# EasyEDA Pro project ProProject_心电第二版（最终版）_2024-06-08.epro

# Schematic schematic1
Create Date: 2024-05-25; Page Name: P1; Project Name: 心电第二版; Schematic Name: schematic1; Update Date: 2024-05-30; Company: 嘉立创EDA; Page Size: A4; Version: V1.0
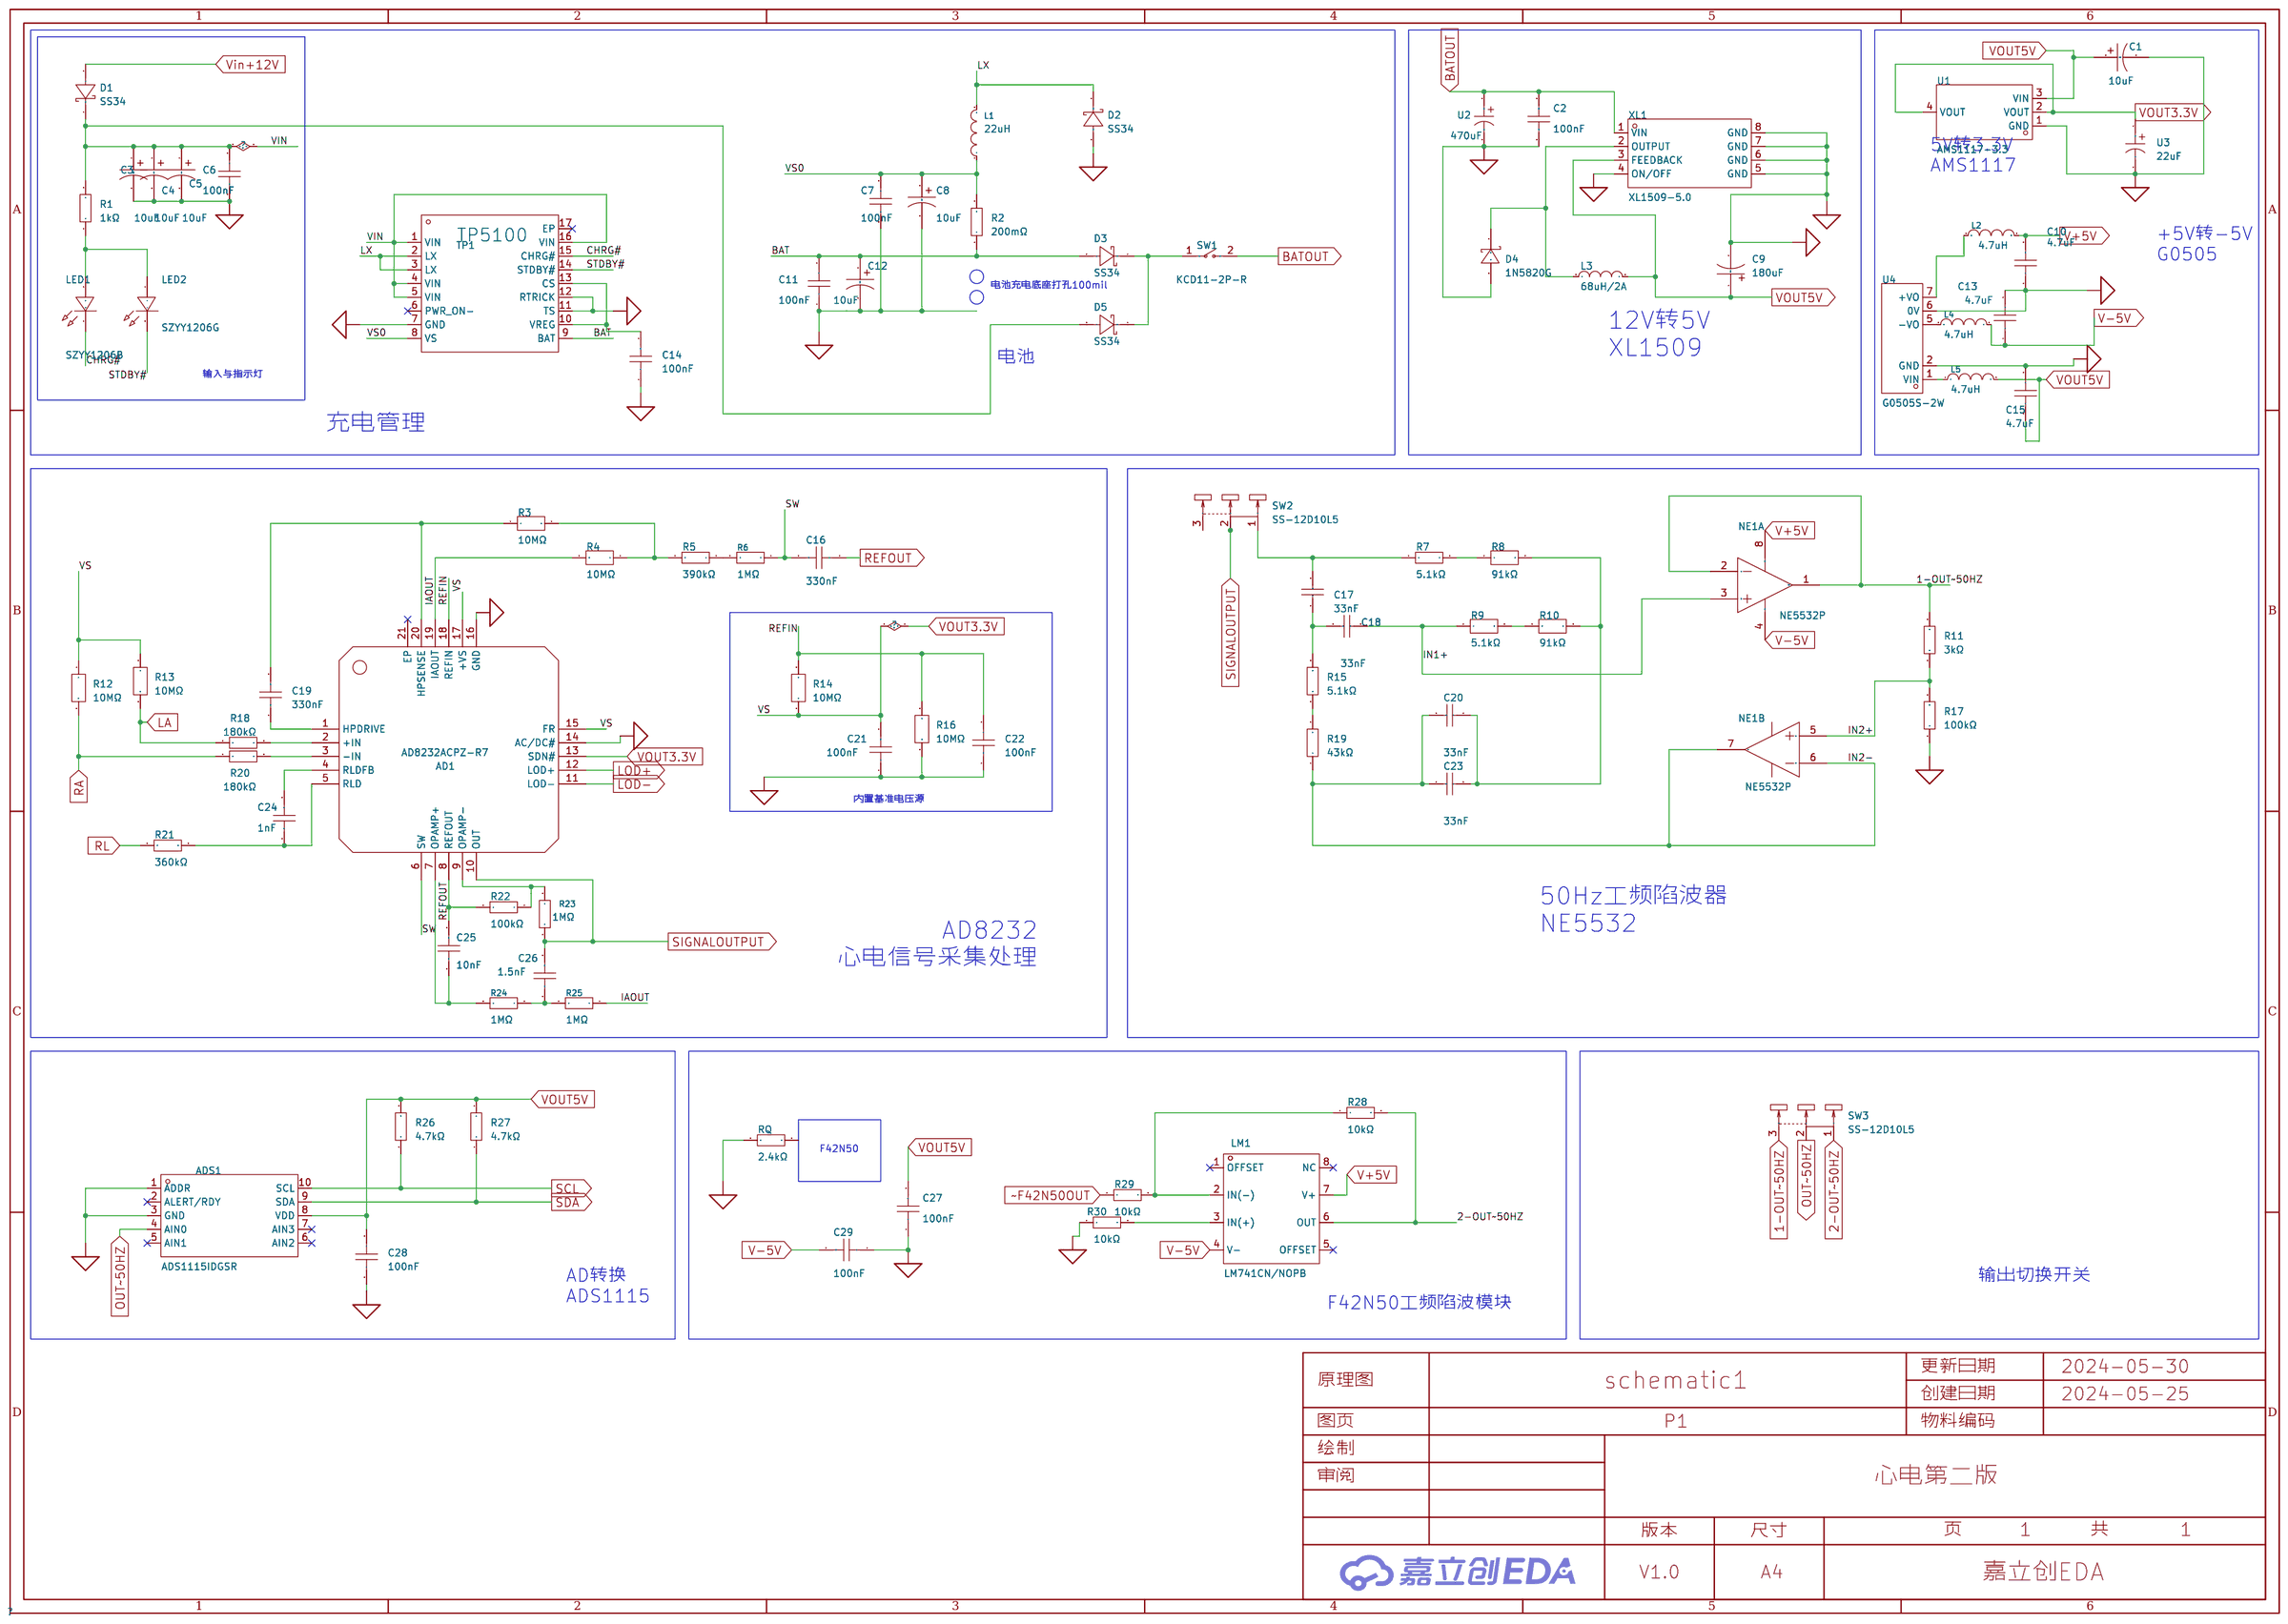
[diagram p0: schematic sheet]

## Parts
AD1  AD8232ACPZ-R7  [LFCSP-20_L4.0-W4.0-P0.50-TL-EP2.7]
ADS1  ADS1115IDGSR  [MSOP-10_L3.0-W3.0-P0.50-LS5.0-BL]
C1  10uF  [CAP-TH_BD5.0-P2.00-D0.8-FD]
C2  100nF  [C1206]
C3  10uF  [CAP-TH_BD5.0-P2.00-D0.8-FD]
C4  10uF  [CAP-TH_BD5.0-P2.00-D0.8-FD]
C5  10uF  [CAP-TH_BD5.0-P2.00-D0.8-FD]
C6  100nF  [C1206]
C7  100nF  [C1206]
C8  10uF  [CAP-TH_BD5.0-P2.00-D0.8-FD]
C9  180uF  [CAP-TH_BD8.0-P3.50-D0.6-FD]
C10  4.7uF  [C1206]
C11  100nF  [C1206]
C12  10uF  [CAP-TH_BD5.0-P2.00-D0.8-FD]
C13  4.7uF  [C1206]
C14  100nF  [C1206]
C15  4.7uF  [C1206]
C16  330nF  [CAP-TH_L6.2-W4.0-P5.00-D0.5]
C17  33nF  [C1206]
C18  33nF  [C1206]
C19  330nF  [CAP-TH_L6.2-W4.0-P5.00-D0.5]
C20  33nF  [C1206]
C21  100nF  [C1206]
C22  100nF  [C1206]
C23  33nF  [C1206]
C24  1nF  [C1206]
C25  10nF  [C1206]
C26  1.5nF  [C1206]
C27  100nF  [C1206]
C28  100nF  [C1206]
C29  100nF  [C1206]
D1  SS34  [SMA_L4.3-W2.5-LS5.0-RD]
D2  SS34  [SMA_L4.3-W2.5-LS5.0-RD]
D3  SS34  [SMA_L4.3-W2.5-LS5.0-RD]
D4  1N5820G  [DO-201AD_BD5.3-L8.4-P12.50-D1.4-RD]
D5  SS34  [SMA_L4.3-W2.5-LS5.0-RD]
L1  22uH  [IND-SMD_L3.2-W2.5]
L2  4.7uH  [IND-SMD_L3.6-W2.2]
L3  68uH/2A  [IND-SMD_L7.1-W6.6]
L4  4.7uH  [IND-SMD_L3.6-W2.2]
L5  4.7uH  [IND-SMD_L3.6-W2.2]
LED1  SZYY1206B  [LED1206-RD_BLUE]
LED2  SZYY1206G  [LED1206-R-RD]
LM1  LM741CN/NOPB  [DIP-8_L9.8-W6.6-P2.54-LS7.6-BL]
NE1  NE5532P  [DIP-8_L9.4-W6.4-P2.54-LS9.1-BL]  (sections 1,2)
R1  1kΩ  [R1206]
R2  200mΩ  [R1206]
R3  10MΩ  [R1206]
R4  10MΩ  [R1206]
R5  390kΩ  [R1206]
R6  1MΩ  [R1206]
R7  5.1kΩ  [R1206]
R8  91kΩ  [R1206]
R9  5.1kΩ  [R1206]
R10  91kΩ  [R1206]
R11  3kΩ  [R1206]
R12  10MΩ  [R1206]
R13  10MΩ  [R1206]
R14  10MΩ  [R1206]
R15  5.1kΩ  [R1206]
R16  10MΩ  [R1206]
R17  100kΩ  [R1206]
R18  180kΩ  [R1206]
R19  43kΩ  [R1206]
R20  180kΩ  [R1206]
R21  360kΩ  [R1206]
R22  100kΩ  [R1206]
R23  1MΩ  [R1206]
R24  1MΩ  [R1206]
R25  1MΩ  [R1206]
R26  4.7kΩ  [R1206]
R27  4.7kΩ  [R1206]
R28  10kΩ  [R1206]
R29  10kΩ  [R1206]
R30  10kΩ  [R1206]
RQ  2.4kΩ  [R1206]
SW1  KCD11-2P-R  [SW-TH_2P-L15.0-W10.5-P5.00_KCD11-2P-R]
SW2  SS-12D10L5  [SW-TH_SS-12D10L5]
SW3  SS-12D10L5  [SW-TH_SS-12D10L5]
TP1  TP5100  [TQFN-16_L4.0-W4.0-P0.65-BL-EP]
U1  AMS1117-3.3  [SOT-223-3_L6.5-W3.4-P2.30-LS7.0-BR]
U2  470uF  [CAP-TH_BD10.0-P5.00-D0.6-FD]
U3  22uF  [CAP-TH_BD5.0-P2.00-D0.5-FD-A]
U4  G0505S-2W  [PWRM-TH_GXXXXS-2W]
XL1  XL1509-5.0  [SOIC-8_L4.9-W3.9-P1.27-LS6.0-TR]

## Library data of the parts
AD1 = AD8232ACPZ-R7: Supplier Part: C43216; Manufacturer: ADI(亚德诺); Supplier Footprint: LFCSP-20(4x4); JLCPCB Part Class: 扩展库; Datasheet: https://atta.szlcsc.com/upload/public/pdf/source/20150319/1457707267132.pdf; Supplier: LCSC
ADS1 = ADS1115IDGSR: 接口:I2C;电源电压:2V~5.5V;采样率:860Hz;分辨率:16位;; LCSC Part Name: 具有内部基准、振荡器和可编程比较器且兼容 I2C 的ADS111x、超小型、低功耗 860SPS、16位ADC; Supplier Part: C37593; Manufacturer: TI(德州仪器); Supplier Footprint: VSSOP-10; JLCPCB Part Class: 扩展库; Datasheet: https://www.ti.com/cn/lit/gpn/ads1115; Supplier: LCSC; Interface: I2C; differential input: 是; number of channels: 2; Supply Voltage: 2V~5.5V; sampling frequency: 860Hz; resolution: 16位; Operating Temperature: -40℃~+125℃
C1 C3-C5 C8 C12 = 01EC1809SHC10UF50V: 容值:10uF;精度:±20%;额定电压:50V;纹波电流:50mA@120Hz;等效串联电阻:-;; LCSC Part Name: 10uF ±20% 50V; Supplier Part: C503219; Manufacturer: KNSCHA(科尼盛); Supplier Footprint: 插件,D5xL11mm; JLCPCB Part Class: 扩展库; Datasheet: https://atta.szlcsc.com/upload/public/pdf/source/20200324/C503219_39D1683F20D4DB1C41D8BE9142629697.pdf; Supplier: LCSC; Tolerance: ±20%; Rated Voltage: 50V; Ripple Current: 50mA@120Hz; Lead Spacing: 2mm; φD: 5mm; L: 11mm; Lifetime @ Temp: 5000hrs@105℃
C2 C6 C7 C11 C14 C21 C22 C27-C29 = GRM31C5C1H104FA01L: 容值:100nF;精度:±1%;额定电压:50V;材质(温度系数):C0G;; LCSC Part Name: 100nF ±1% 50V; Supplier Part: C2981728; Manufacturer: muRata(村田); Supplier Footprint: 1206; JLCPCB Part Class: 扩展库; Datasheet: https://atta.szlcsc.com/upload/public/pdf/source/20220324/AFC21CC486B7CF14E6B473B87A9DA315.pdf; Supplier: LCSC; Tolerance: ±1%; Voltage Rated: 50V; Temperature Coefficient: C0G
C9 = LKMD0901V181MF: 容值:180uF;精度:±20%;额定电压:35V;纹波电流:900mA@100kHz;等效串联电阻:210mΩ@100kHz;; LCSC Part Name: 180uF ±20% 35V; Supplier Part: C442870; Manufacturer: Ymin(永铭); Supplier Footprint: 插件,D8xL9mm; JLCPCB Part Class: 扩展库; Datasheet: https://atta.szlcsc.com/upload/public/pdf/source/20200220/C487520_443A40905984A455D375EE990FEAA9E8.pdf; Supplier: LCSC; Tolerance: ±20%; Rated Voltage: 35V; Ripple Current: 900mA@100kHz; Equivalent Series Resistance(ESR): 210mΩ@100kHz; Lead Spacing: 3.5mm; φD: 8mm; L: 9mm; Lifetime @ Temp: 10000hrs@105℃
C10 C13 C15 = 1206B475K160NT: 容值:4.7uF;精度:±10%;额定电压:16V;材质(温度系数):X7R;; LCSC Part Name: 4.7uF ±10% 16V; Supplier Part: C313095; Manufacturer: FH(风华); Supplier Footprint: 1206; JLCPCB Part Class: 扩展库; Datasheet: https://atta.szlcsc.com/upload/public/pdf/source/20200305/C486355_26A10D38EF8C2A5C37091D0039909270.pdf; Supplier: LCSC; Tolerance: ±10%; Voltage Rated: 16V; Temperature Coefficient: X7R
C16 C19 = MPE334J100V82CL0053: 容值:330nF;精度:±5%;额定电压:100V;介电材料:金属化聚酯;工作温度:-55℃~+85℃;; LCSC Part Name: 330nF ±5% 100V; Supplier Part: C2831918; Manufacturer: KNSCHA(科尼盛); Supplier Footprint: 插件,P=5mm; JLCPCB Part Class: 扩展库; Datasheet: https://atta.szlcsc.com/upload/public/pdf/source/20210511/C2831918_4A90EB5B7D9A48C608572A886A05E91B.pdf; Supplier: LCSC; Tolerance: ±5%; Voltage Rated: 100V; Dielectric Material: 金属化聚酯; Operating Temperature: -55℃~+85℃
C17 C18 C20 C23 = GRM3195C1H333JA01D: 容值:33nF;精度:±5%;额定电压:50V;材质(温度系数):C0G;; LCSC Part Name: 33nF ±5% 50V; Supplier Part: C97930; Manufacturer: muRata(村田); Supplier Footprint: 1206; JLCPCB Part Class: 扩展库; Datasheet: https://atta.szlcsc.com/upload/public/pdf/source/20180228/C97930_15198056805791377691.pdf; Supplier: LCSC; Tolerance: ±5%; Voltage Rated: 50V; Temperature Coefficient: C0G
C24 = CC1206FRNPO9BN102: 容值:1nF;精度:±1%；±1%;额定电压:50V;材质(温度系数):NP0;; LCSC Part Name: 1nF ±1% ±1% 50V; Supplier Part: C541590; Manufacturer: YAGEO(国巨); Supplier Footprint: 1206; JLCPCB Part Class: 扩展库; Datasheet: https://atta.szlcsc.com/upload/public/pdf/source/20200615/C541590_477071E071F342D05882972A0B2AED0F.pdf; Supplier: LCSC; Tolerance: ±1%；±1%; Voltage Rated: 50V; Temperature Coefficient: NP0
C25 = CC1206FKNPO9BN103: 容值:10nF;精度:±1%；±1%;额定电压:50V;材质(温度系数):NP0;; LCSC Part Name: 10nF ±1% ±1% 50V; Supplier Part: C541597; Manufacturer: YAGEO(国巨); Supplier Footprint: 1206; JLCPCB Part Class: 扩展库; Datasheet: https://atta.szlcsc.com/upload/public/pdf/source/20200615/C541597_B7982166218BFC921458D5A7C4672911.pdf; Supplier: LCSC; Tolerance: ±1%；±1%; Voltage Rated: 50V; Temperature Coefficient: NP0
C26 = CC1206FRNPO9BN152: 容值:1.5nF;精度:±1%；±1%;额定电压:50V;材质(温度系数):NP0;; LCSC Part Name: 1.5nF ±1% ±1% 50V; Supplier Part: C541592; Manufacturer: YAGEO(国巨); Supplier Footprint: 1206; JLCPCB Part Class: 扩展库; Datasheet: https://atta.szlcsc.com/upload/public/pdf/source/20200615/C541592_3F4656DF1E5D9C97744F2AE17570802B.pdf; Supplier: LCSC; Tolerance: ±1%；±1%; Voltage Rated: 50V; Temperature Coefficient: NP0
D1-D3 D5 = SS34_C727060: 二极管配置:独立式;正向压降(Vf):550mV@3A;直流反向耐压(Vr):40V;平均整流电流(Io):3A;; LCSC Part Name: 电压:40V 电流:3A; Supplier Part: C727060; Manufacturer: TWGMC(台湾迪嘉); Supplier Footprint: SMA(DO-214AC); JLCPCB Part Class: 扩展库; Datasheet: https://atta.szlcsc.com/upload/public/pdf/source/20200828/C727059_6599B6CAC5F3238B9C33E46794659DBE.pdf; Supplier: LCSC; Diode Configuration: 独立式; Forward Voltage (Vf@If): 550mV@3A; Reverse Voltage (Vr): 40V; Average Rectified Current (Io): 3A; Reverse Leakage Current (Ir): 500uA@40V
D4 = 1N5820G: 正向压降(Vf):475mV@3A;直流反向耐压(Vr):20V;平均整流电流(Io):3A;; LCSC Part Name: 电压:20V 电流:3A; Supplier Part: C95400; Manufacturer: onsemi(安森美); Supplier Footprint: DO-201AD; JLCPCB Part Class: 扩展库; Datasheet: https://atta.szlcsc.com/upload/public/pdf/source/20221020/278CB0A15AF2705A206F2F139E5C3CB6.pdf; Supplier: LCSC; Forward Voltage (Vf@If): 475mV@3A; Reverse Voltage (Vr): 20V; Average Rectified Current (Io): 3A; Reverse Leakage Current (Ir): 2mA@20V
L1 = NLV32T-220J-EF: 电感值:22uH;精度:±5%;额定电流:110mA;饱和电流(Isat):-;; LCSC Part Name: 22uH ±5%; Supplier Part: C295143; Manufacturer: TDK; Supplier Footprint: 1210; JLCPCB Part Class: 扩展库; Datasheet: https://atta.szlcsc.com/upload/public/pdf/source/20190114/C295361_7F4084769062E2B02C18E7F2085EC2BC.pdf; Supplier: LCSC; Tolerance: ±5%; Rated Current: 110mA; DC Resistance (DCR): 3.7Ω
L2 L4 L5 = SDWL3216FW4R7JSTF: 电感值:4.7uH;精度:±5%;额定电流:280mA;饱和电流(Isat):-;直流电阻(DCR):2.2Ω;; LCSC Part Name: 4.7uH ±5%; Supplier Part: C431696; Manufacturer: Sunlord(顺络); Supplier Footprint: 1206; JLCPCB Part Class: 扩展库; Datasheet: https://atta.szlcsc.com/upload/public/pdf/source/20231027/7EEA3220EB2F2EE34EA6471ABDB7138B.pdf; Supplier: LCSC; Tolerance: ±5%; Rated Current: 280mA; DC Resistance (DCR): 2.2Ω
L3 = SMMS0650-680M: 电感值:68uH;精度:±20%;额定电流:1.5A;饱和电流(Isat):2A;类型:一体成型电感;; LCSC Part Name: 68uH ±20% 2A; Supplier Part: C2894721; Manufacturer: SXN(顺翔诺); Supplier Footprint: SMD,6.6x7.1mm; JLCPCB Part Class: 扩展库; Datasheet: https://atta.szlcsc.com/upload/public/pdf/source/20210910/523B6BB0C4A09F37806A127B1ABE761D.pdf; Supplier: LCSC; Tolerance: ±20%; Rated Current: 1.5A; Saturation Current (Isat): 2A; DC Resistance (DCR): 442mΩ; Type: 一体成型电感
LED1 = SZYY1206B: 发光颜色:蓝色;功率:100mW;正向电流:5mA;主波长:460nm~475nm;二极管配置:-;透镜颜色:无色透明透镜;色温:-;发光角度:120°;载带方式:-;工作温度:-40℃~+85℃;; LCSC Part Name: 蓝灯; Supplier Part: C434440; Manufacturer: yongyu(永裕光电); Supplier Footprint: 1206; JLCPCB Part Class: 扩展库; Datasheet: https://atta.szlcsc.com/upload/public/pdf/source/20200628/C434440_4695B106742D2A5A4116465A96970157.pdf; Supplier: LCSC; Emitted Color: 蓝色; Power Dissipation: 100mW; Forward Current: 5mA; Dominant Wavelength: 460nm~475nm; Peak Wavelength: 469nm; Lens Color: 无色透明透镜; Viewing Angle: 120°; Operating Temperature: -40℃~+85℃
LED2 = SZYY1206G: 发光颜色:翠绿色;; LCSC Part Name: 翠绿; Supplier Part: C434439; Manufacturer: yongyu(永裕光电); Supplier Footprint: 1206; JLCPCB Part Class: 扩展库; Datasheet: https://atta.szlcsc.com/upload/public/pdf/source/20200628/C434439_0A6287F1EA2604FB8C8003896F01CB92.pdf; Supplier: LCSC; Emitted Color: 翠绿色
LM1 = LM741CN/NOPB: 放大器数:单路;增益带宽积(GBP):1.5MHz;输入偏置电流(Ib):80nA;压摆率(SR):0.5V/us;带宽(-3db):-;; Supplier Part: C13974; Manufacturer: TI(德州仪器); Supplier Footprint: DIP-8; JLCPCB Part Class: 扩展库; Datasheet: https://www.ti.com/cn/lit/gpn/lm741; Supplier: LCSC; Number of Circuits: 单路; Gain Bandwidth Product(GBP): 1.5MHz; Current - Input Bias(Ib): 80nA; Slew Rate(SR): 0.5V/us; Output Current: 25mA; Supply Current: 1.5mA; Operating Temperature: 0℃~+70℃
NE1 = NE5532P: 放大器数:双路;增益带宽积(GBP):10MHz;输入偏置电流(Ib):200nA;压摆率(SR):9V/us;带宽(-3db):-;; Supplier Part: C5326; Manufacturer: TI(德州仪器); Supplier Footprint: DIP-8; JLCPCB Part Class: 扩展库; Datasheet: https://www.ti.com/cn/lit/gpn/ne5532; Supplier: LCSC; Number of Circuits: 双路; Gain Bandwidth Product(GBP): 10MHz; Current - Input Bias(Ib): 200nA; Slew Rate(SR): 9V/us; Output Current: 38mA; Supply Current: 8mA; Operating Temperature: 0℃~+70℃
R1 = 1206W4F1001T5E_C4410: 电阻类型:厚膜电阻;阻值:1kΩ;精度:±1%;功率:250mW;最大工作电压:200V;; LCSC Part Name: 1kΩ ±1% 250mW 厚膜电阻; Supplier Part: C4410; Manufacturer: UNI-ROYAL(厚声); Manufacturer Part: 1206W4F1001T5E; Supplier Footprint: 1206; JLCPCB Part Class: 基础库; Datasheet: https://atta.szlcsc.com/upload/public/pdf/source/20200306/C422600_1E6D84923E4A46A82E41ADD87F860B5C.pdf; Supplier: LCSC; Type: 厚膜电阻; Tolerance: ±1%; Power(Watts): 250mW; Overload Voltage (Max): 200V; Operating Temperature Range: -55℃~+155℃
R2 = RL12FTNR200: 阻值:200mΩ;精度:±1%;功率:500mW;温度系数:±200ppm/℃;; LCSC Part Name: 200mΩ ±1% 500mW; Supplier Part: C160920; Manufacturer: 大毅科技; Supplier Footprint: 1206; JLCPCB Part Class: 扩展库; Datasheet: https://atta.szlcsc.com/upload/public/pdf/source/20180614/C188071_126E822E8169D657E3D39CA4797EDEB1.pdf; Supplier: LCSC; Tolerance: ±1%; Power(Watts): 500mW; Temperature Coefficient: ±200ppm/℃
R3 R4 R12-R14 R16 = RC1206FR-0710ML: 电阻类型:厚膜电阻;阻值:10MΩ;精度:±1%;功率:250mW;最大工作电压:200V;温度系数:±100ppm/℃;; LCSC Part Name: 厚膜电阻 10MΩ ±1% 250mW; Supplier Part: C275643; Manufacturer: YAGEO(国巨); Supplier Footprint: 1206; JLCPCB Part Class: 扩展库; Datasheet: https://atta.szlcsc.com/upload/public/pdf/source/20191125/C364360_EA870FADD46A2AD4DBE56DD50D360B3E.pdf; Supplier: LCSC; Type: 厚膜电阻; Tolerance: ±1%; Power(Watts): 250mW; Overload Voltage (Max): 200V; Temperature Coefficient: ±100ppm/℃; Operating Temperature Range: -55℃~+155℃
R5 = 1206W4F3903T5E: 电阻类型:厚膜电阻;阻值:390kΩ;精度:±1%;功率:250mW;最大工作电压:200V;温度系数:±100ppm/℃;; LCSC Part Name: 390kΩ ±1% 250mW 厚膜电阻; Supplier Part: C17933; Manufacturer: UNI-ROYAL(厚声); Supplier Footprint: 1206; JLCPCB Part Class: 扩展库; Datasheet: https://atta.szlcsc.com/upload/public/pdf/source/20200306/C422600_1E6D84923E4A46A82E41ADD87F860B5C.pdf; Supplier: LCSC; Type: 厚膜电阻; Tolerance: ±1%; Power(Watts): 250mW; Overload Voltage (Max): 200V; Temperature Coefficient: ±100ppm/℃; Operating Temperature Range: -55℃~+155℃
R6 R23-R25 = RT1206BRD071ML: 电阻类型:薄膜电阻;阻值:1MΩ;精度:±0.1%;功率:250mW;最大工作电压:200V;温度系数:±25ppm/℃;; LCSC Part Name: 薄膜电阻 1MΩ ±0.1% 250mW; Supplier Part: C309662; Manufacturer: YAGEO(国巨); Supplier Footprint: 1206; JLCPCB Part Class: 扩展库; Datasheet: https://atta.szlcsc.com/upload/public/pdf/source/20181009/C309664_C7CEF5A7F4D0541F96EF5E54D941D229.pdf; Supplier: LCSC; Type: 薄膜电阻; Tolerance: ±0.1%; Power(Watts): 250mW; Overload Voltage (Max): 200V; Temperature Coefficient: ±25ppm/℃; Operating Temperature Range: -55℃~+155℃
R7 R9 R15 = PTFR1206B5K10N9: 电阻类型:薄膜电阻;阻值:5.1kΩ;精度:±0.1%;功率:250mW;最大工作电压:200V;温度系数:±10ppm/℃;; LCSC Part Name: 薄膜电阻 5.1kΩ ±0.1% 250mW; Supplier Part: C2692709; Manufacturer: RESI(开步睿思）; Supplier Footprint: 1206; JLCPCB Part Class: 扩展库; Datasheet: https://atta.szlcsc.com/upload/public/pdf/source/20231020/37F75D505DFC5CA75CC16B0F0ECD8764.pdf; Supplier: LCSC; Type: 薄膜电阻; Tolerance: ±0.1%; Power(Watts): 250mW; Overload Voltage (Max): 200V; Temperature Coefficient: ±10ppm/℃; Operating Temperature Range: -55℃~+125℃
R8 R10 = RT1206BRD0791KL: 电阻类型:薄膜电阻;阻值:91kΩ;精度:±0.1%;功率:250mW;温度系数:±25ppm/℃;; LCSC Part Name: 薄膜电阻 91kΩ ±0.1% 250mW; Supplier Part: C870937; Manufacturer: YAGEO(国巨); Supplier Footprint: 1206; JLCPCB Part Class: 扩展库; Datasheet: https://atta.szlcsc.com/upload/public/pdf/source/20200610/C326738_5639A9F1B6EB6E4AE2197577D3456E7F.pdf; Supplier: LCSC; Type: 薄膜电阻; Tolerance: ±0.1%; Power(Watts): 250mW; Temperature Coefficient: ±25ppm/℃; Operating Temperature Range: -55℃~+155℃
R11 = 1206W4F3001T5E: 电阻类型:厚膜电阻;阻值:3kΩ;精度:±1%;功率:250mW;最大工作电压:200V;温度系数:±100ppm/℃;; LCSC Part Name: 3kΩ ±1% 250mW 厚膜电阻; Supplier Part: C18012; Manufacturer: UNI-ROYAL(厚声); Supplier Footprint: 1206; JLCPCB Part Class: 扩展库; Datasheet: https://atta.szlcsc.com/upload/public/pdf/source/20200306/C422600_1E6D84923E4A46A82E41ADD87F860B5C.pdf; Supplier: LCSC; Type: 厚膜电阻; Tolerance: ±1%; Power(Watts): 250mW; Overload Voltage (Max): 200V; Temperature Coefficient: ±100ppm/℃; Operating Temperature Range: -55℃~+155℃
R17 R22 = 1206W4F1003T5E: 电阻类型:厚膜电阻;阻值:100kΩ;精度:±1%;功率:250mW;最大工作电压:200V;温度系数:±100ppm/℃;; LCSC Part Name: 100kΩ ±1% 250mW 厚膜电阻; Supplier Part: C17900; Manufacturer: UNI-ROYAL(厚声); Supplier Footprint: 1206; JLCPCB Part Class: 基础库; Datasheet: https://atta.szlcsc.com/upload/public/pdf/source/20200306/C422600_1E6D84923E4A46A82E41ADD87F860B5C.pdf; Supplier: LCSC; Type: 厚膜电阻; Tolerance: ±1%; Power(Watts): 250mW; Overload Voltage (Max): 200V; Temperature Coefficient: ±100ppm/℃; Operating Temperature Range: -55℃~+155℃
R18 R20 = 1206W4F1803T5E: 电阻类型:厚膜电阻;阻值:180kΩ;精度:±1%;功率:250mW;最大工作电压:200V;温度系数:±100ppm/℃;; LCSC Part Name: 180kΩ ±1% 250mW 厚膜电阻; Supplier Part: C17923; Manufacturer: UNI-ROYAL(厚声); Supplier Footprint: 1206; JLCPCB Part Class: 扩展库; Datasheet: https://atta.szlcsc.com/upload/public/pdf/source/20200306/C422600_1E6D84923E4A46A82E41ADD87F860B5C.pdf; Supplier: LCSC; Type: 厚膜电阻; Tolerance: ±1%; Power(Watts): 250mW; Overload Voltage (Max): 200V; Temperature Coefficient: ±100ppm/℃; Operating Temperature Range: -55℃~+155℃
R19 = AR06BTDV4302: 电阻类型:薄膜电阻;阻值:43kΩ;精度:±0.1%;功率:250mW;最大工作电压:150V;温度系数:±50ppm/℃;; LCSC Part Name: 薄膜电阻 43kΩ ±0.1% 250mW; Supplier Part: C319635; Manufacturer: Viking(光颉); Supplier Footprint: 1206; JLCPCB Part Class: 扩展库; Datasheet: https://atta.szlcsc.com/upload/public/pdf/source/20191129/C465721_10D49275DB41E427863CE9C8D788770A.pdf; Supplier: LCSC; Type: 薄膜电阻; Tolerance: ±0.1%; Power(Watts): 250mW; Overload Voltage (Max): 150V; Temperature Coefficient: ±50ppm/℃; Operating Temperature Range: -55℃~+155℃
R21 = 1206W4F3603T5E: 电阻类型:厚膜电阻;阻值:360kΩ;精度:±1%;功率:250mW;最大工作电压:200V;温度系数:±100ppm/℃;; LCSC Part Name: 360kΩ ±1% 250mW 厚膜电阻; Supplier Part: C17931; Manufacturer: UNI-ROYAL(厚声); Supplier Footprint: 1206; JLCPCB Part Class: 扩展库; Datasheet: https://atta.szlcsc.com/upload/public/pdf/source/20200306/C422600_1E6D84923E4A46A82E41ADD87F860B5C.pdf; Supplier: LCSC; Type: 厚膜电阻; Tolerance: ±1%; Power(Watts): 250mW; Overload Voltage (Max): 200V; Temperature Coefficient: ±100ppm/℃; Operating Temperature Range: -55℃~+155℃
R26 R27 = ARG06DTC4701: 电阻类型:薄膜电阻;阻值:4.7kΩ;精度:±0.5%;功率:250mW;最大工作电压:150V;温度系数:±25ppm/℃;; LCSC Part Name: 薄膜电阻 4.7kΩ ±0.5% 250mW; Supplier Part: C311962; Manufacturer: Viking(光颉); Supplier Footprint: 1206; JLCPCB Part Class: 扩展库; Datasheet: https://atta.szlcsc.com/upload/public/pdf/source/20190816/C412422_E173BA386C6DD8245B6A88358EF9877A.pdf; Supplier: LCSC; Type: 薄膜电阻; Tolerance: ±0.5%; Power(Watts): 250mW; Overload Voltage (Max): 150V; Temperature Coefficient: ±25ppm/℃; Operating Temperature Range: -55℃~+155℃
R28-R30 = RT1206BRD0710KL: 电阻类型:薄膜电阻;阻值:10kΩ;精度:±0.1%;功率:250mW;最大工作电压:200V;温度系数:±25ppm/℃;; LCSC Part Name: 薄膜电阻 10kΩ ±0.1% 250mW; Supplier Part: C136889; Manufacturer: YAGEO(国巨); Supplier Footprint: 1206; JLCPCB Part Class: 扩展库; Datasheet: https://atta.szlcsc.com/upload/public/pdf/source/20181009/C309664_C7CEF5A7F4D0541F96EF5E54D941D229.pdf; Supplier: LCSC; Type: 薄膜电阻; Tolerance: ±0.1%; Power(Watts): 250mW; Overload Voltage (Max): 200V; Temperature Coefficient: ±25ppm/℃; Operating Temperature Range: -55℃~+155℃
RQ = RC1206FR-072K4L: 电阻类型:厚膜电阻;阻值:2.4kΩ;精度:±1%;功率:250mW;最大工作电压:200V;温度系数:±100ppm/℃;; LCSC Part Name: 厚膜电阻 2.4kΩ ±1% 250mW; Supplier Part: C137331; Manufacturer: YAGEO(国巨); Supplier Footprint: 1206; JLCPCB Part Class: 扩展库; Datasheet: https://atta.szlcsc.com/upload/public/pdf/source/20180821/C275644_0D56F95EFF785E7D9A1FEF436B37DA78.pdf; Supplier: LCSC; Type: 厚膜电阻; Tolerance: ±1%; Power(Watts): 250mW; Overload Voltage (Max): 200V; Temperature Coefficient: ±100ppm/℃; Operating Temperature Range: -55℃~+155℃
SW1 = KCD11-2P-R: 带灯:无;引脚样式:焊片;额定电流:3A;额定电压(AC):250V;额定电压(DC):-;电路结构:单刀单掷;机械寿命:1万次;; LCSC Part Name: 10.5*15mm 两脚两档跷板开关 红钮; Supplier Part: C5884414; Manufacturer: SHOU HAN(首韩); Supplier Footprint: 插件; JLCPCB Part Class: 扩展库; Datasheet: https://atta.szlcsc.com/upload/public/pdf/source/20230506/CD06DFDE35C8048D34175BFF4AF6A2C2.pdf; Supplier: LCSC; Switch Length: 15mm; Switch Width: 10.5mm; Switch Height: 17.2mm; Actuator Type: 凹面弯曲; With Lamp: 无; Pin Style: 焊片; Actuator Color: 红色; Contact Current: 3A; Voltage Rating (AC): 250V; Circuit: 单刀单掷; Mechanical Life: 1万次; Operating Temperature: 0℃~+125℃; Actuator Identifier: - O
SW2 SW3 = SS-12D10L5: 电路结构:单刀双掷;安装方式:直插;开关颜色:黑色;额定电流(DC):3A;额定电压(DC):125V;额定电流(AC):3A;额定电压(AC):125V;机械寿命:1万次;; LCSC Part Name: 柄长5mm 直插双档 滑动开关; Supplier Part: C319012; Manufacturer: XKB Connectivity(中国星坤); Supplier Footprint: 插件; JLCPCB Part Class: 扩展库; Datasheet: https://atta.szlcsc.com/upload/public/pdf/source/20211009/D6412F37AABE6F9459A6EE7FA4DAEADB.pdf; Supplier: LCSC; Circuit: 单刀双掷; Actuator Style: 矩形柱状; Pin Style: PC引脚; Switch Length: 13mm; Switch Width: 6.8mm; Switch Height: 6.4mm; Mounting Style: 直插; Actuator Color: 黑色; Current Rating (DC): 3A; Voltage Rating (DC): 125V; Current Rating (AC): 3A; Voltage Rating (AC): 125V; Mechanical Life: 1万次; Operating Temperature: -40℃~+85℃
TP1 = TP5100: Supplier Part: C379389; Manufacturer: TOPPOWER(南京拓微); Supplier Footprint: TQFN-16-EP(4x4); JLCPCB Part Class: 扩展库; Datasheet: https://atta.szlcsc.com/upload/public/pdf/source/20230625/310531CA6E48A76C009AF7A61C581768.pdf; Supplier: LCSC
U1 = AMS1117-3.3_C6186: 输出类型:固定;最大输入电压:-;输出电压:3.3V;最大输出电流:1A;电源纹波抑制比(PSRR):72dB@(120Hz);输出极性:正极;; LCSC Part Name: 输出3.3V 1A; Supplier Part: C6186; Manufacturer: AMS; Supplier Footprint: SOT-223-3; JLCPCB Part Class: 基础库; Datasheet: https://atta.szlcsc.com/upload/public/pdf/source/20180727/C6186_7A095716F0823C02F1997A905E26C086.pdf; Supplier: LCSC; Output Type: 固定; Output Voltage: 3.3V; MAX Output Current: 1A; Power Supply Rejection Ratio (PSRR): 72dB@(120Hz); Dropout Voltage: 1.3V@(800mA); Output Polarity: 正极; Number of Outputs: 1
U2 = 03EC0563: 容值:470uF;精度:±20%;额定电压:35V;纹波电流:480mA@120kHz;等效串联电阻:-;; LCSC Part Name: 470uF ±20% 35V; Supplier Part: C2687410; Manufacturer: KNSCHA(科尼盛); Supplier Footprint: 插件,D10xL16mm; JLCPCB Part Class: 扩展库; Datasheet: https://atta.szlcsc.com/upload/public/pdf/source/20210128/C2687410_09D5236BC46E67836277EE63A33C2923.pdf; Supplier: LCSC; Tolerance: ±20%; Rated Voltage: 35V; Ripple Current: 480mA@120kHz; Lead Spacing: 5mm; φD: 10mm; L: 16mm; Lifetime @ Temp: 2000hrs@105℃; Operating Temperature: -40℃~+105℃
U3 = KM1H220M0511: 容值:22uF;精度:±20%;额定电压:50V;纹波电流:78mA@120kHz;等效串联电阻:-;; LCSC Part Name: 22uF ±20% 50V; Supplier Part: C2873981; Manufacturer: ROQANG(容强); Supplier Footprint: 插件,D5xL11mm; JLCPCB Part Class: 扩展库; Datasheet: https://atta.szlcsc.com/upload/public/pdf/source/20210825/43CC5C3A3C9845108B639C21E16A1224.pdf; Supplier: LCSC; Tolerance: ±20%; Rated Voltage: 50V; Ripple Current: 78mA@120kHz; Lead Spacing: 2mm; φD: 5mm; L: 11mm; Lifetime @ Temp: 2000hrs@105℃; Operating Temperature: -40℃~+105℃
U4 = G0505S-2W_C5198573: Supplier Part: C5198573; Manufacturer: JETEKPS(健特); Supplier Footprint: SIP-5; JLCPCB Part Class: 扩展库; Datasheet: https://atta.szlcsc.com/upload/public/pdf/source/20221014/C0DAC248E4DACD92D62ABC90D36325F6.pdf; Supplier: LCSC
XL1 = XL1509-5.0: Supplier Part: C2902368; Manufacturer: UMW(友台半导体); Supplier Footprint: SOIC-8; JLCPCB Part Class: 扩展库; Datasheet: https://atta.szlcsc.com/upload/public/pdf/source/20231109/DE54E433DAEEB90BED9FFB0414881778.pdf; Supplier: LCSC

## Nets
AGND: AD1.14(AC/DC#) AD1.16(GND) ADS1.1(ADDR) ADS1.3(GND) C1.2 C2.1 C3.2 C4.2 C5.2 C6.1 C7.1 C8.2 C9.2 C10.1 C11.1 C12.2 C13.2 C14.1 C15.2 C21.1 C22.1 C27.1 C28.1 C29.1 D2.2(A) D4.2(A) R16.1 R17.1 R30.1 RQ.1 TP1.7(GND) TP1.11(TS) TP1.12(RTRICK) U1.1(GND) U2.2 U3.2 U4.2(GND) U4.6(0V) XL1.4(ON/OFF) XL1.5(GND) XL1.6(GND) XL1.7(GND) XL1.8(GND)
VIN: C3.1 C4.1 C5.1 C6.2 D1.1(C) D5.2(A) R1.2 TP1.1(VIN) TP1.4(VIN) TP1.5(VIN) TP1.16(VIN)
Vin+12V: D1.2(A)
1-OUT~50HZ: NE1.1(OUT1) NE1.2(IN1-) R11.2 SW3.3
2-OUT~50HZ: LM1.6(OUT) R28.2 SW3.1
BAT: C11.2 C12.1 D3.2(A) R2.1 TP1.9(BAT)
BATOUT: C2.2 SW1.2 U2.1 XL1.1(VIN)
CHRG#: LED1.1 TP1.15(CHRG#)
IAOUT: AD1.19(IAOUT) R4.2 R25.1
IN1+: C18.1 NE1.3(IN1+) R9.1
IN2+: NE1.5(IN2+) R11.1 R17.2
IN2-: C20.2 C23.2 NE1.6(IN2-) NE1.7(OUT2) R19.1
LA: R13.2 R18.1
LOD+: AD1.12(LOD+)
LOD-: AD1.11(LOD-)
LX: D2.1(C) L1.2 TP1.2(LX) TP1.3(LX)
OUT~50HZ: ADS1.4(AIN0) SW3.2
RA: R12.2 R20.1
REFIN: AD1.18(REFIN) C22.2 R14.2 R16.2
REFOUT: AD1.8(REFOUT) C16.1 C25.2 R22.2
RL: R21.1
SCL: ADS1.10(SCL) R26.1
SDA: ADS1.9(SDA) R27.1
SIGNALOUTPUT: AD1.10(OUT) C26.2 R23.1 SW2.2
STDBY#: LED2.2(-) TP1.14(STDBY#)
SW: AD1.6(SW) C16.2 R6.1
V+5V: C10.2 L2.2 LM1.7(V+) NE1.8(VCC+)
V-5V: C13.1 C29.2 L4.2 LM1.4(V-) NE1.4(VCC-)
VOUT3.3V: AD1.13(SDN#) AD1.15(FR) AD1.17(+VS) C21.2 R12.1 R13.1 R14.1 U1.2(VOUT) U1.4(VOUT) U3.1
VOUT5V: ADS1.8(VDD) C1.1 C9.1 C15.1 C27.2 C28.2 L3.1 L5.2 R26.2 R27.2 U1.3(VIN) XL1.3(FEEDBACK)
VS0: C7.2 C8.1 L1.1 R2.2 TP1.8(VS)
~F42N50OUT: R29.1
$1N3439: D4.1(C) L3.2 XL1.2(OUTPUT)
$1N4811: AD1.1(HPDRIVE) C19.1
$1N5112: AD1.20(HPSENSE) C19.2 R3.1
$1N5226: R5.1 R6.2
$1N5744: R3.2 R4.1 R5.2
$1N5889: AD1.2(+IN) R18.2
$1N5893: AD1.3(-IN) R20.2
$1N6263: AD1.4(RLDFB) C24.2
$1N6271: AD1.5(RLD) C24.1 R21.2
$1N6443: C26.1 R24.1 R25.2
$1N6667: AD1.7(OPAMP+) C25.1 R24.2
$1N6683: AD1.9(OPAMP-) R22.1 R23.2
$1N9016: LED1.2 LED2.1(+) R1.1
$1N9469: C14.2 TP1.10(VREG) TP1.13(CS)
$1N13462: D3.1(C) D5.1(C) SW1.1
$1N13836: C20.1 C23.1 R8.2 R10.2
$1N13923: R7.2 R8.1
$1N14048: R9.2 R10.1
$1N14109: C17.1 C18.2 R15.2
$1N14110: R15.1 R19.2
$1N16761: C17.2 R7.1 SW2.1
$1N30838: L5.1 U4.1(VIN)
$1N30849: L4.1 U4.5(-VO)
$1N30860: L2.1 U4.7(+VO)
Net-(LM1-2): LM1.2(IN(-)) R28.1 R29.2
Net-(LM1-3): LM1.3(IN(+)) R30.2

Not connected (* = marked no-connect by the designer): AD1 21(EP)*; ADS1 2(ALERT/RDY)* 5(AIN1)* 6(AIN2)* 7(AIN3)*; LM1 1(OFFSET)* 5(OFFSET)* 8(NC)*; RQ 2; SW2 3; TP1 6(PWR_ON-)* 17(EP)*

## Notes on the sheet
- 5V转3.3V
  AMS1117
- +5V转-5V
  G0505
- 电池充电底座打孔100mil
- 电池
- 12V转5V
  XL1509
- 输入与指示灯
- 充电管理
- 内置基准电压源
- 50Hz工频陷波器
  NE5532
- AD8232
  心电信号采集处理
- F42N50
- 输出切换开关
- AD转换
  ADS1115
- F42N50工频陷波模块

# Board PCB1
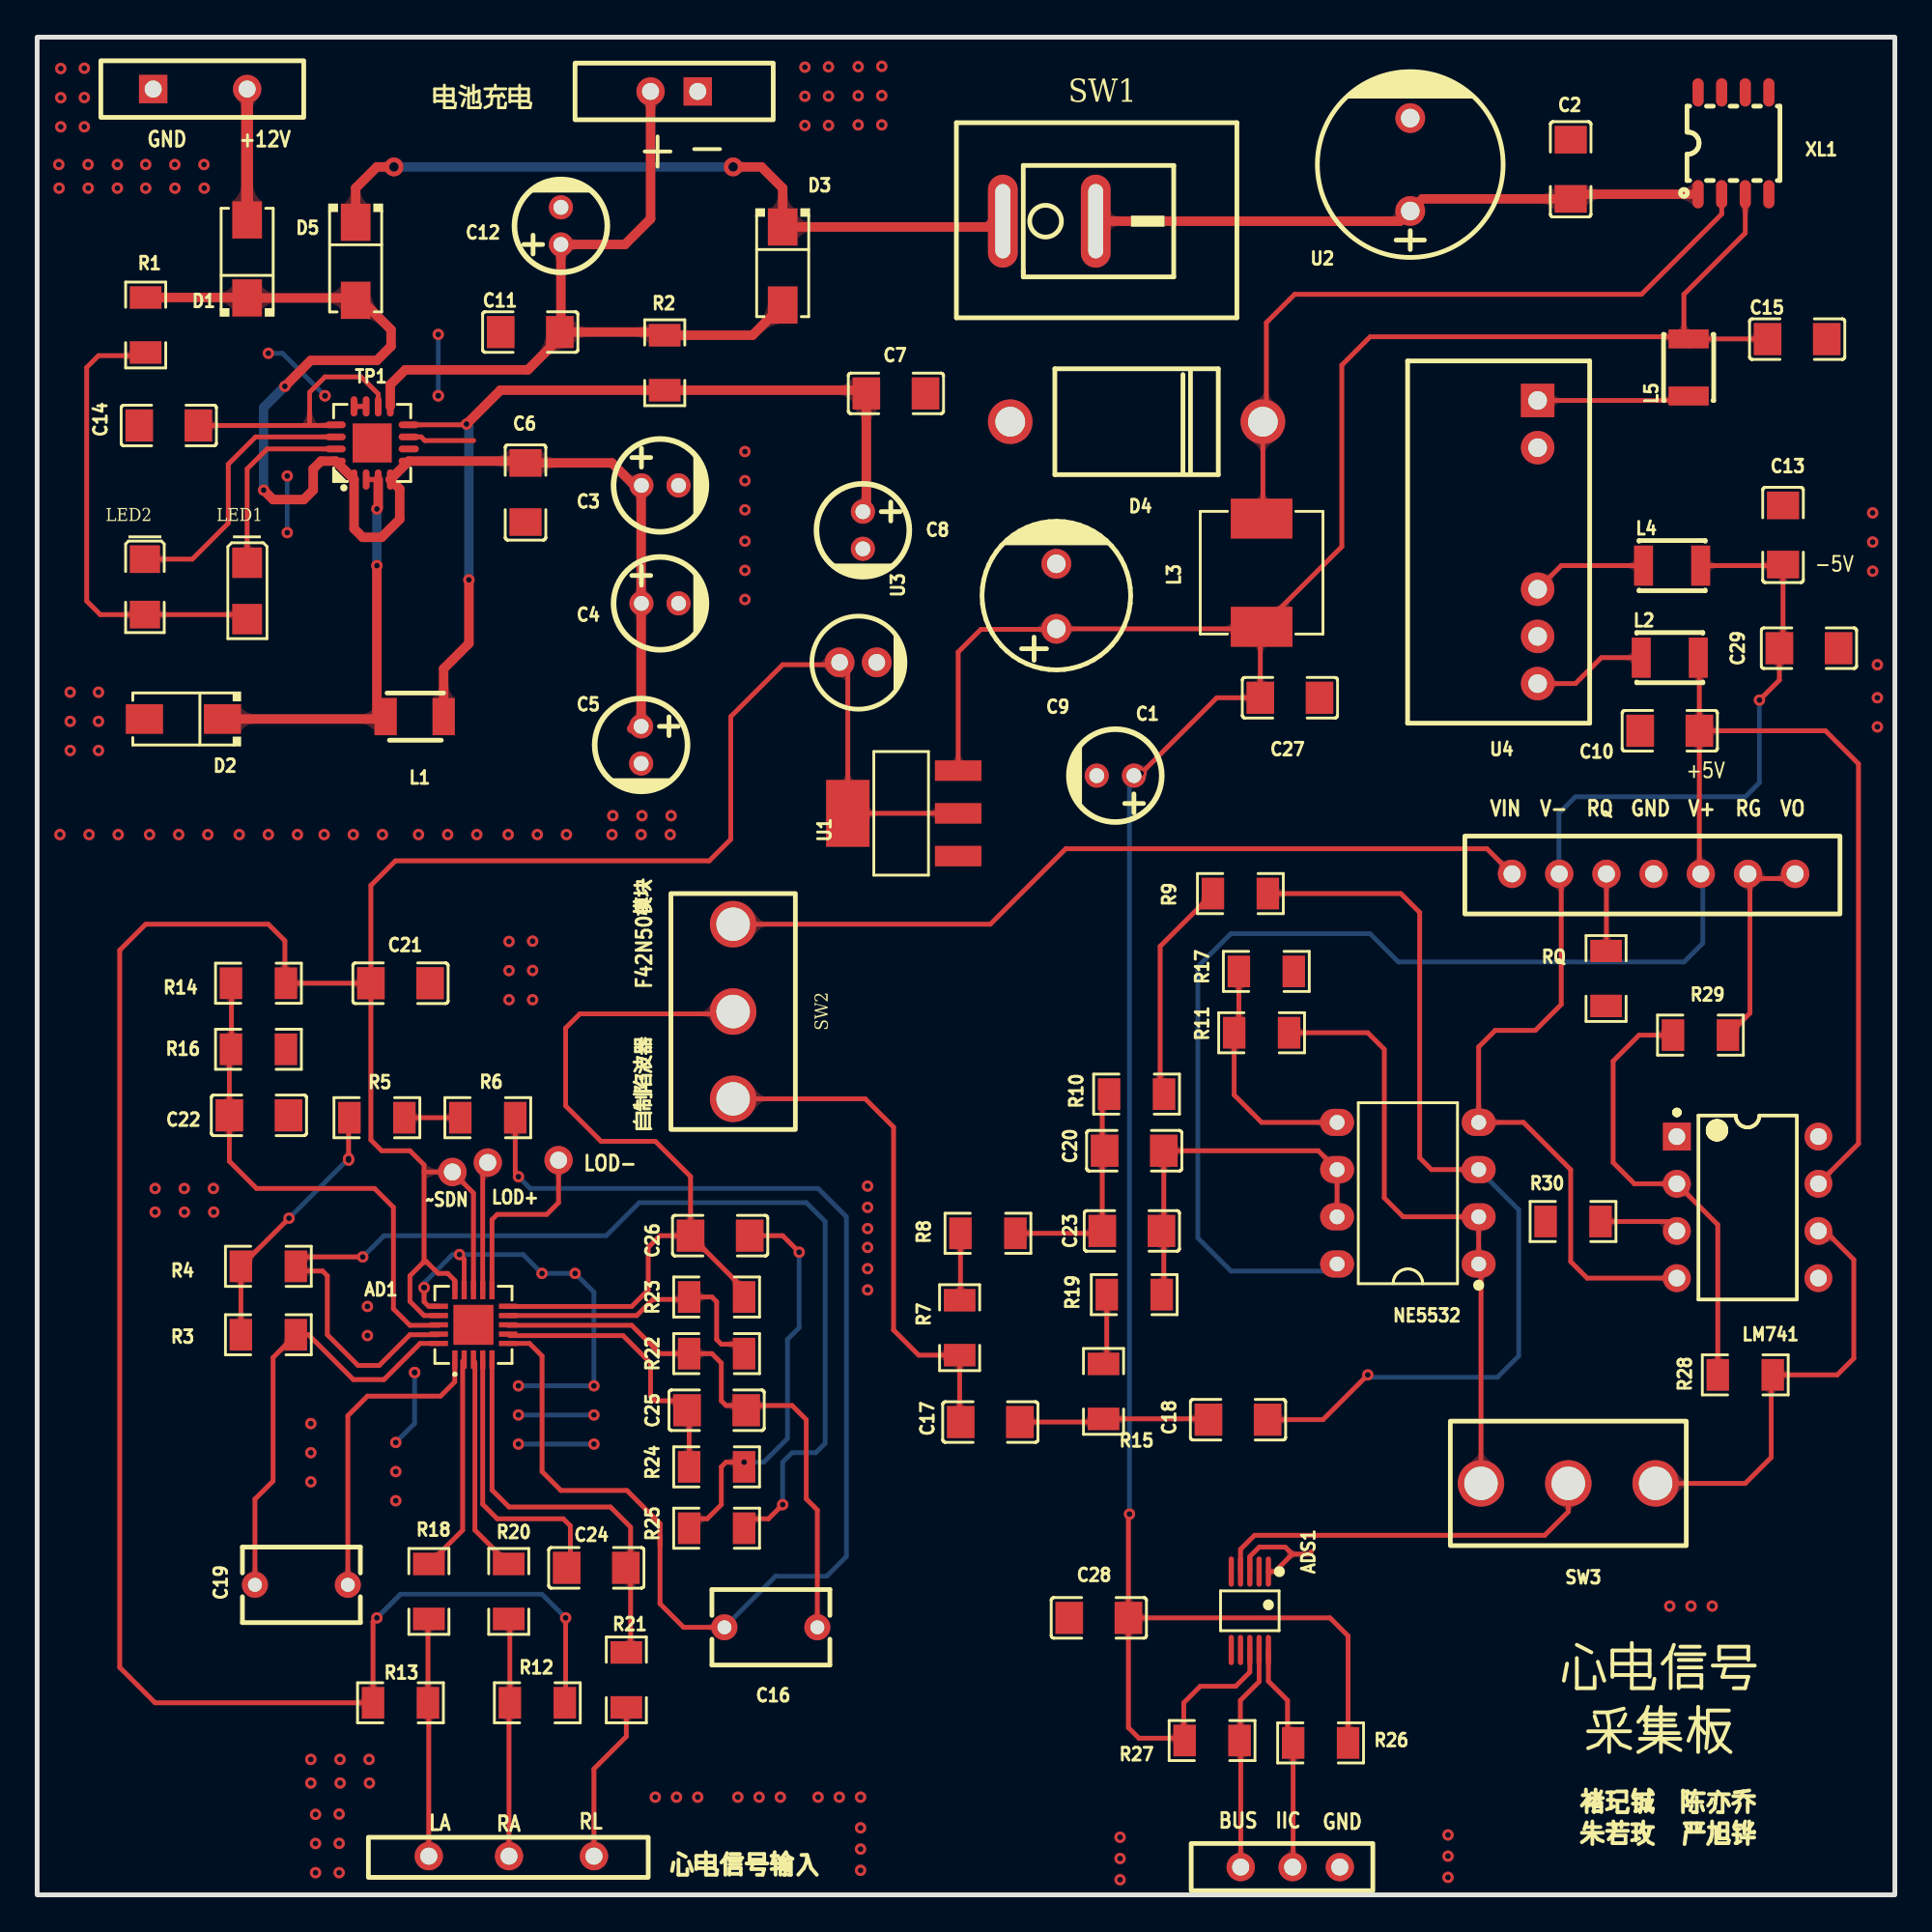
[diagram p1: board, top side]
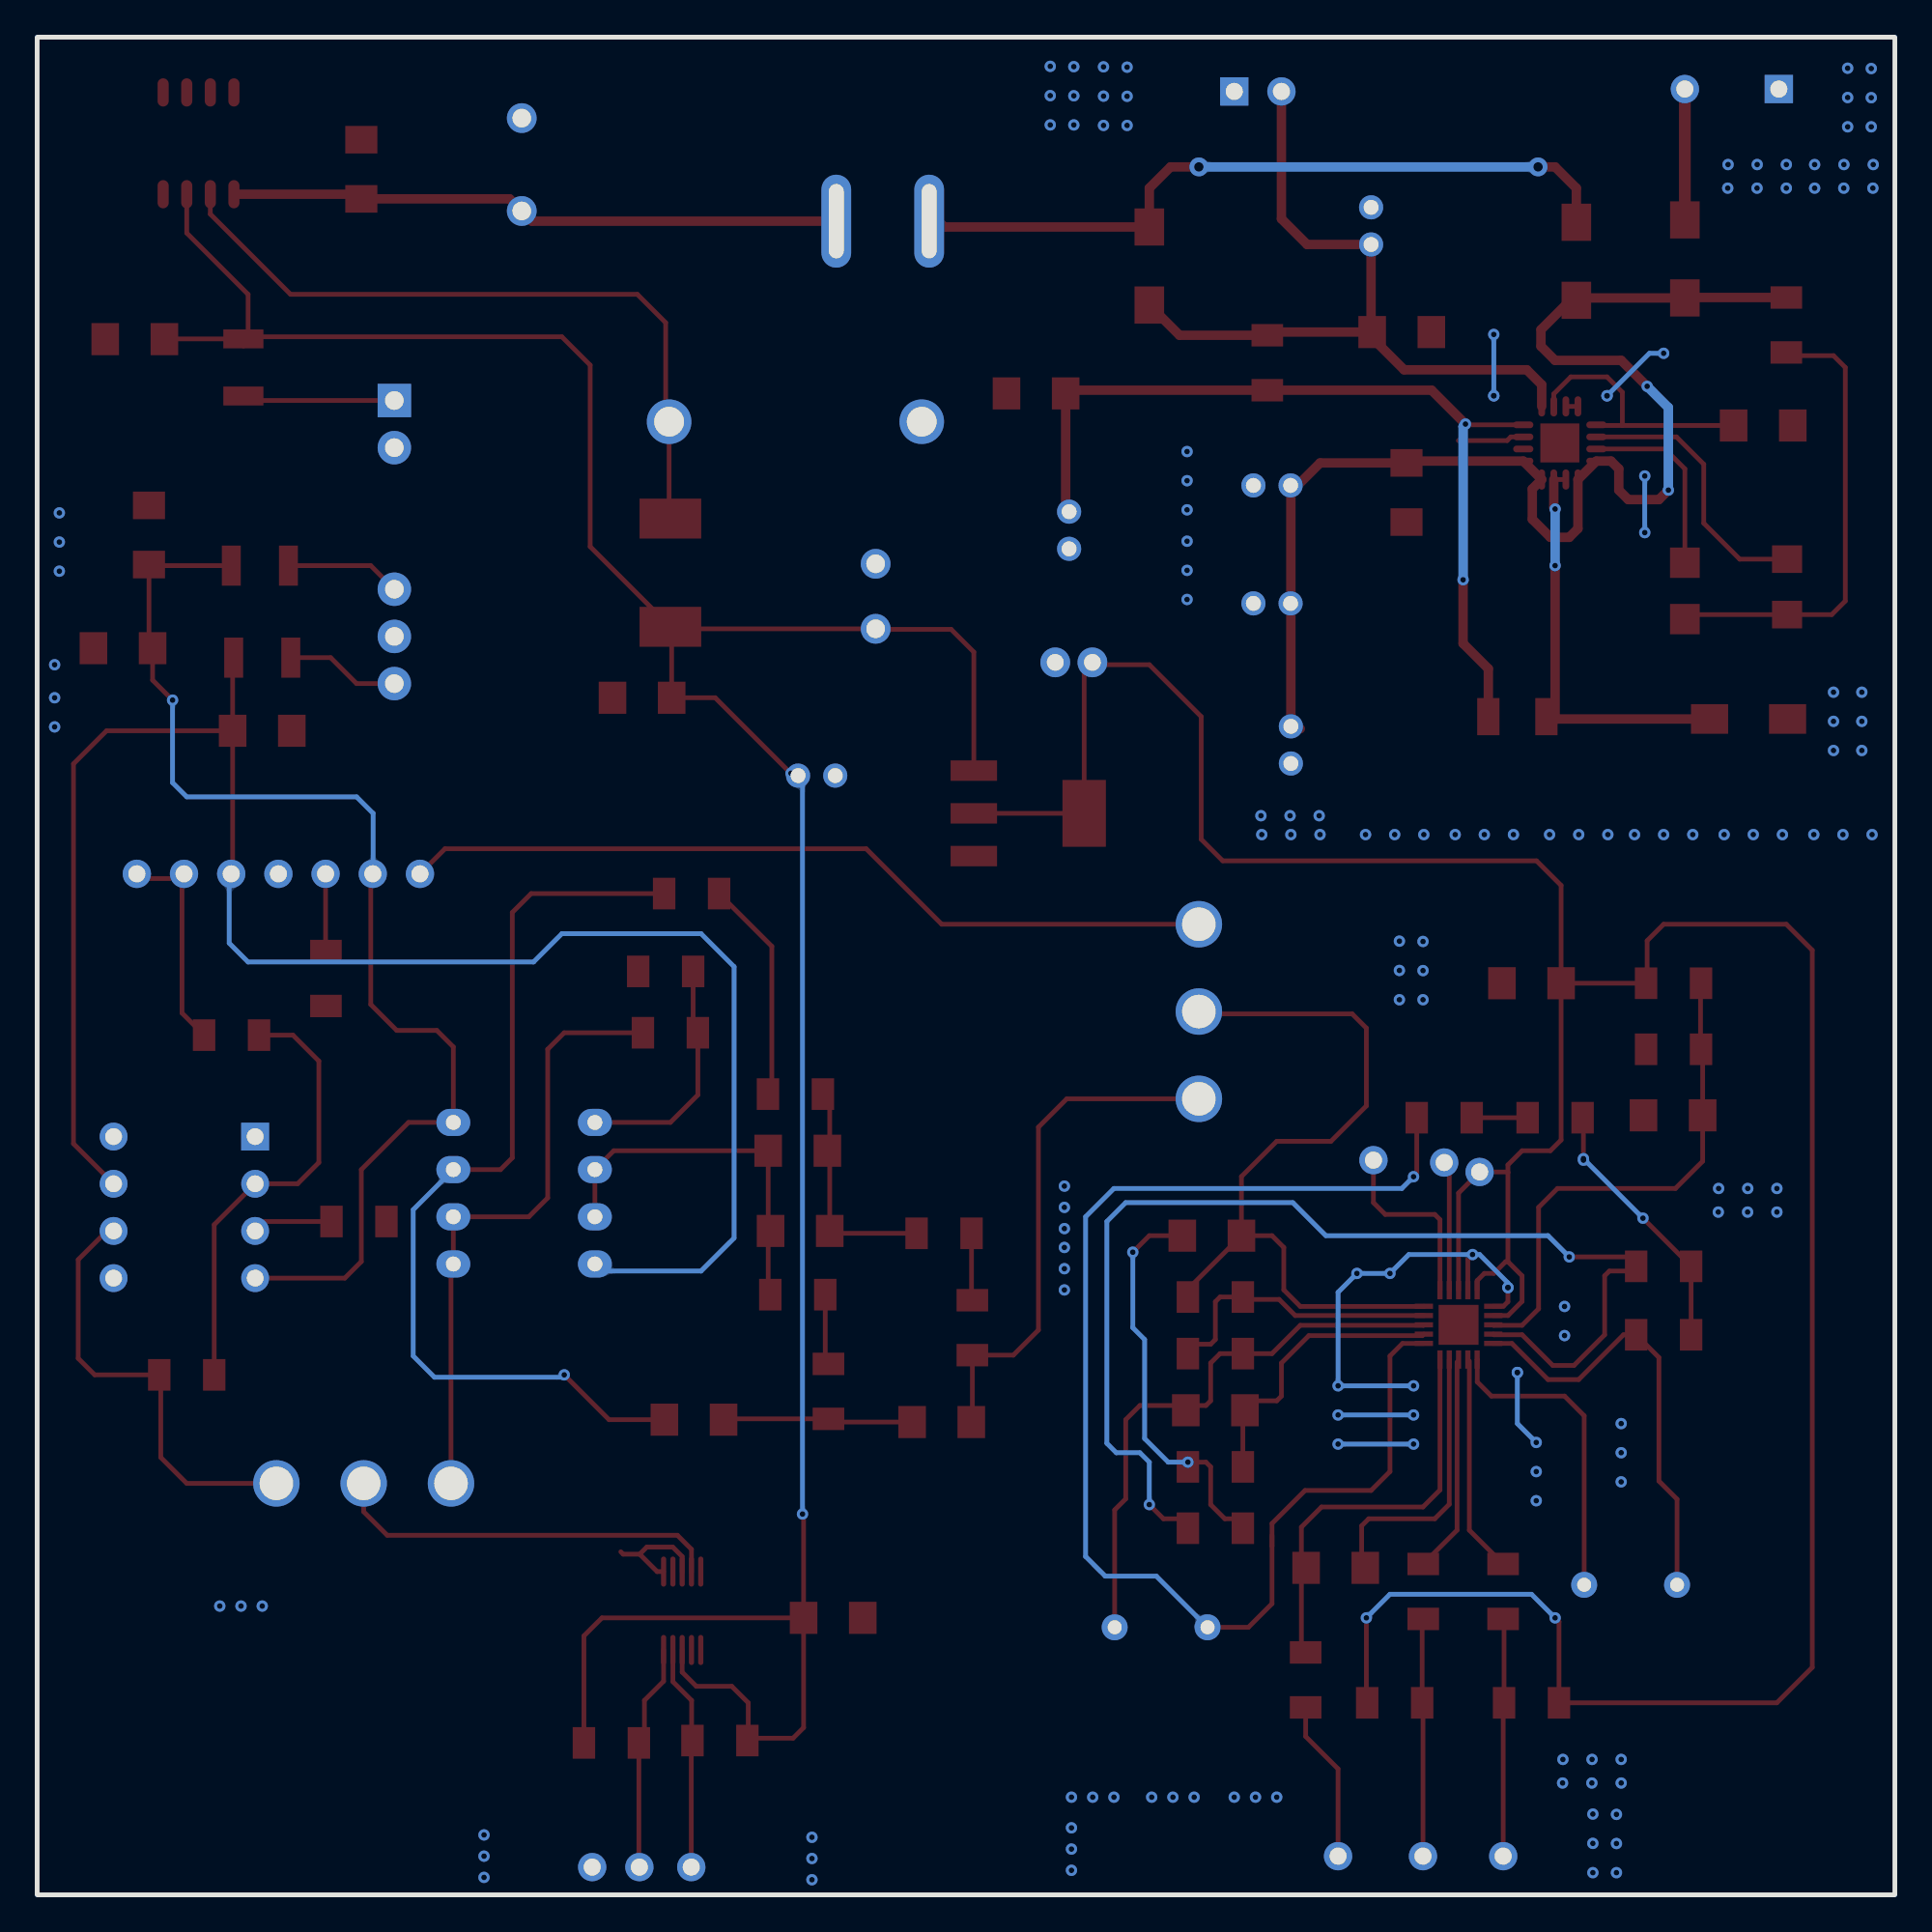
[diagram p2: board, bottom side, seen from below]

Outline 100 x 100 mm; copper layers: Top Layer, Bottom Layer. Coordinates in mm from the lower left corner of the outline.
Outline path: rectangle 0,100 100,0
Stack: Top Layer 0.035mm / Dielectric1 1.51mm FR4 er 4.5 / Bottom Layer 0.035mm

## Design rules (mm)
net $1N5889: DP2
net $1N5893: DP2
net RA: DP1
net LA: DP1
template: 自定义配置
spacing copperThickness1oz (default): track to track 0.102, other pairs 0.152 to 0.3
spacing copperThickness2oz: track to track 0.203, other pairs 0.152 to 0.3
track width copperThickness1oz (default): min 0.127, default 0.254, max 2.54
track width copperThickness2oz: min 0.203, default 0.254, max 2.54
differential pair differentialPair (default): width min 0.127, default 0.254, max 2.54; gap min 0.152, default 0.152
via viaSize (default): diameter min 0.5, default 0.61, max 10; hole min 0.3, default 0.305, max 6.299
net AGND uses AGND

## Placement (name value [footprint] x y rotation side)
AD1  AD8232ACPZ-R7  [LFCSP-20_L4.0-W4.0-P0.50-TL-EP2.7]  23.49 30.68 90 top
ADS1  ADS1115IDGSR  [MSOP-10_L3.0-W3.0-P0.50-LS5.0-BL]  65.28 15.29 180 top
C1  10uF  [CAP-TH_BD5.0-P2.00-D0.8-FD]  58.04 60.25 180 top
C2  100nF  [C1206]  82.55 92.89 270 top
C3  10uF  [CAP-TH_BD5.0-P2.00-D0.8-FD]  33.53 75.87 0 top
C4  10uF  [CAP-TH_BD5.0-P2.00-D0.8-FD]  33.53 69.52 0 top
C5  10uF  [CAP-TH_BD5.0-P2.00-D0.8-FD]  32.51 61.9 270 top
C6  100nF  [C1206]  26.29 75.49 90 top
C7  100nF  [C1206]  46.23 80.82 180 top
C8  10uF  [CAP-TH_BD5.0-P2.00-D0.8-FD]  44.45 73.46 270 top
C9  180uF  [CAP-TH_BD8.0-P3.50-D0.6-FD]  54.86 69.9 90 top
C10  4.7uF  [C1206]  87.88 62.66 0 top
C11  100nF  [C1206]  26.54 84.12 0 top
C12  10uF  [CAP-TH_BD5.0-P2.00-D0.8-FD]  28.19 89.84 90 top
C13  4.7uF  [C1206]  93.98 73.2 90 top
C14  100nF  [C1206]  7.09 79.1 0 top
C15  4.7uF  [C1206]  94.74 83.74 0 top
C16  330nF  [CAP-TH_L6.2-W4.0-P5.00-D0.5]  39.5 14.4 180 top
C17  33nF  [C1206]  51.31 25.45 180 top
C18  33nF  [C1206]  64.64 25.58 180 top
C19  330nF  [CAP-TH_L6.2-W4.0-P5.00-D0.5]  14.22 16.69 180 top
C20  33nF  [C1206]  59.06 40.06 0 top
C21  100nF  [C1206]  19.56 49.07 180 top
C22  100nF  [C1206]  11.94 41.96 180 top
C23  33nF  [C1206]  58.93 35.74 0 top
C24  1nF  [C1206]  30.1 17.6 180 top
C25  10nF  [C1206]  36.58 26.09 0 top
C26  1.5nF  [C1206]  36.76 35.48 180 top
C27  100nF  [C1206]  67.44 64.44 180 top
C28  100nF  [C1206]  57.15 14.91 0 top
C29  100nF  [C1206]  95.38 67.11 180 top
D1  SS34  [SMA_L4.3-W2.5-LS5.0-RD]  11.3 88.06 90 top
D2  SS34  [SMA_L4.3-W2.5-LS5.0-RD]  7.87 63.3 180 top
D3  SS34  [SMA_L4.3-W2.5-LS5.0-RD]  40.13 87.68 270 top
D4  1N5820G  [DO-201AD_BD5.3-L8.4-P12.50-D1.4-RD]  59.18 79.3 180 top
D5  SS34  [SMA_L4.3-W2.5-LS5.0-RD]  17.14 87.94 270 top
L1  22uH  [IND-SMD_L3.2-W2.5]  20.32 63.42 180 top
L2  4.7uH  [IND-SMD_L3.6-W2.2]  87.88 66.6 0 top
L3  68uH/2A  [IND-SMD_L7.1-W6.6]  65.91 71.17 90 top
L4  4.7uH  [IND-SMD_L3.6-W2.2]  88.01 71.55 0 top
L5  4.7uH  [IND-SMD_L3.6-W2.2]  88.9 82.22 90 top
LED1  SZYY1206B  [LED1206-RD_BLUE]  11.3 70.19 270 top
LED2  SZYY1206G  [LED1206-R-RD]  5.8 70.41 270 top
LM741  LM741CN/NOPB  [DIP-8_L9.8-W6.6-P2.54-LS7.6-BL]  92.07 37.01 270 top
NE5532  NE5532P  [DIP-8_L9.4-W6.4-P2.54-LS9.1-BL]  73.79 37.77 90 top
NOREF  -  [Pad_e117]  87.01 54.96 0 top
NOREF#2  -  [Pad_e115]  79.39 54.96 0 top
NOREF#3  -  [Pad_e95]  64.79 1.49 270 top
NOREF#4  -  [Pad_e723]  24.26 39.42 0 top
NOREF#5  -  [Pad_e121]  81.93 54.96 0 top
NOREF#6  -  [Pad_e119]  94.63 54.96 0 top
NOREF#7  -  [Pad_e1327]  22.35 38.91 0 top
NOREF#8  -  [Pad_e98]  25.4 2.08 0 top
NOREF#9  -  [Pad_e1951]  28.07 39.55 0 top
NOREF#10  -  [Pad_e106]  6.25 97.21 0 top
NOREF#11  -  [Pad_e1208]  70.12 1.49 270 top
NOREF#12  -  [Pad_e116]  84.47 54.96 0 top
NOREF#13  -  [Pad_e91]  33.02 97.08 0 top
NOREF#14  -  [Pad_e94]  67.58 1.49 270 top
NOREF#15  -  [Pad_e97]  21.08 2.08 0 top
NOREF#16  -  [Pad_e92]  35.56 97.08 0 top
NOREF#17  -  [Pad_e118]  92.09 54.96 0 top
NOREF#18  -  [Pad_e99]  29.97 2.08 0 top
NOREF#19  -  [Pad_e120]  89.55 54.96 0 top
NOREF#20  -  [Pad_e105]  11.3 97.21 0 top
R1  1kΩ  [R1206]  5.84 84.51 90 top
R2  200mΩ  [R1206]  33.78 82.47 270 top
R3  10MΩ  [R1206]  12.45 30.15 180 top
R4  10MΩ  [R1206]  12.45 33.83 0 top
R5  390kΩ  [R1206]  18.29 41.83 180 top
R6  1MΩ  [R1206]  24.26 41.83 180 top
R7  5.1kΩ  [R1206]  49.66 30.53 90 top
R8  91kΩ  [R1206]  51.18 35.61 0 top
R9  5.1kΩ  [R1206]  64.77 53.9 180 top
R10  91kΩ  [R1206]  59.18 43.1 180 top
R11  3kΩ  [R1206]  65.91 46.41 0 top
R12  10MΩ  [R1206]  26.92 10.34 180 top
R13  10MΩ  [R1206]  19.56 10.34 0 top
R14  10MΩ  [R1206]  11.91 49.07 180 top
R15  5.1kΩ  [R1206]  57.4 27.1 270 top
R16  10MΩ  [R1206]  11.91 45.52 180 top
R17  100kΩ  [R1206]  66.17 49.71 180 top
R18  180kΩ  [R1206]  21.09 16.33 90 top
R19  43kΩ  [R1206]  59.06 32.31 180 top
R20  180kΩ  [R1206]  25.39 16.33 90 top
R21  360kΩ  [R1206]  31.72 11.57 90 top
R22  100kΩ  [R1206]  36.58 29.13 180 top
R23  1MΩ  [R1206]  36.58 32.18 180 top
R24  1MΩ  [R1206]  36.58 23.04 180 top
R25  1MΩ  [R1206]  36.58 19.74 180 top
R26  4.7kΩ  [R1206]  69.09 8.18 0 top
R27  4.7kΩ  [R1206]  63.25 8.31 180 top
R28  10kΩ  [R1206]  91.95 27.99 0 top
R29  10kΩ  [R1206]  89.53 46.28 180 top
R30  10kΩ  [R1206]  82.68 36.25 0 top
RQ  2.4kΩ  [R1206]  84.46 49.33 90 top
SW1  KCD11-2P-R  [SW-TH_2P-L15.0-W10.5-P5.00_KCD11-2P-R]  54.48 90.09 0 top
SW2  SS-12D10L5  [SW-TH_SS-12D10L5]  37.47 47.55 90 top
SW3  SS-12D10L5  [SW-TH_SS-12D10L5]  82.42 22.15 180 top
TP1  TP5100  [TQFN-16_L4.0-W4.0-P0.65-BL-EP]  18.03 78.16 0 top
U1  AMS1117-3.3  [SOT-223-3_L6.5-W3.4-P2.30-LS7.0-BR]  46.61 58.22 0 top
U2  470uF  [CAP-TH_BD10.0-P5.00-D0.6-FD]  73.91 93.14 90 top
U3  22uF  [CAP-TH_BD5.0-P2.00-D0.5-FD-A]  44.2 66.34 0 top
U4  G0505S-2W  [PWRM-TH_GXXXXS-2W]  80.77 72.82 270 top
XL1  XL1509-5.0  [SOIC-8_L4.9-W3.9-P1.27-LS6.0-TR]  91.31 94.28 180 top

## Footprints (pads in the part's own frame, mm; a bottom-side part is the same pattern mirrored in y, then rotated)
C1206
  rect 1.485x1.728 smd: 1(-1.593,0) 2(1.593,0)
CAP-TH_BD5.0-P2.00-D0.5-FD-A
  round 1.6 hole 0.9: 1(-1,0) 2(1,0)
CAP-TH_BD5.0-P2.00-D0.8-FD
  round 1.3 hole 0.8: 1(-1,0) 2(1,0)
CAP-TH_BD8.0-P3.50-D0.6-FD
  round 1.6 hole 1: 1(-1.75,0) 2(1.75,0)
CAP-TH_BD10.0-P5.00-D0.6-FD
  round 1.6 hole 1: 1(-2.5,0) 2(2.5,0)
CAP-TH_L6.2-W4.0-P5.00-D0.5
  round 1.4 hole 0.75: 1(-2.5,0) 2(2.5,0)
DIP-8_L9.4-W6.4-P2.54-LS9.1-BL
  oval 1.46x1.825 hole 0.8: 1(-3.81,-3.81) 2(-1.27,-3.81) 3(1.27,-3.81) 4(3.81,-3.81) 5(3.81,3.81) 6(1.27,3.81) 7(-1.27,3.81) 8(-3.81,3.81)
DIP-8_L9.8-W6.6-P2.54-LS7.6-BL
  rect 1.5x1.5 hole 0.9: 1(-3.81,-3.81)
  round 1.5 hole 0.9: 2(-1.27,-3.81) 3(1.27,-3.81) 4(3.81,-3.81) 5(3.81,3.81) 6(1.27,3.81) 7(-1.27,3.81) 8(-3.81,3.81)
DO-201AD_BD5.3-L8.4-P12.50-D1.4-RD
  round 2.4 hole 1.6: 1(-6.8,0) 2(6.8,0)
IND-SMD_L3.2-W2.5
  rect 1.2x2 smd: 1(-1.562,0) 2(1.562,0)
IND-SMD_L3.6-W2.2
  rect 1.02x2.16 smd: 1(-1.537,0) 2(1.537,0)
IND-SMD_L7.1-W6.6
  rect 2.15x3.32 smd: 1(-2.913,0) 2(2.913,0)
LED1206-R-RD
  rect 1.485x1.62 smd: 1(1.492,0) 2(-1.492,0)
LED1206-RD_BLUE
  rect 1.635x1.6 smd: 1(-1.518,0) 2(1.518,0)
LFCSP-20_L4.0-W4.0-P0.50-TL-EP2.7
  rect 0.985x0.28 smd: 1(-1.867,1) 2(-1.867,0.5) 3(-1.867,0) 4(-1.867,-0.5) 5(-1.867,-1) 11(1.867,-1) 12(1.867,-0.5) 13(1.867,0) 14(1.867,0.5) 15(1.867,1)
  rect 0.28x0.985 smd: 6(-1,-1.867) 7(-0.5,-1.867) 8(0,-1.867) 9(0.5,-1.867) 10(1,-1.867) 16(1,1.867) 17(0.5,1.867) 18(0,1.867) 19(-0.5,1.867) 20(-1,1.867)
  rect 2.15x2.15 smd: 21(0,0)
MSOP-10_L3.0-W3.0-P0.50-LS5.0-BL
  oval 0.28x1.62 smd: 1(-1,-2.11) 2(-0.5,-2.11) 3(0,-2.11) 4(0.5,-2.11) 5(1,-2.11) 6(1,2.11) 7(0.5,2.11) 8(0,2.11) 9(-0.5,2.11) 10(-1,2.11)
Pad_e91
  round 1.524 hole 0.914: 22(0,0)
Pad_e92
  rect 1.524x1.524 hole 0.914: 23(0,0)
Pad_e94
  round 1.524 hole 0.914: 24(0,0)
Pad_e95
  round 1.524 hole 0.914: 25(0,0)
Pad_e97
  round 1.524 hole 0.914: 26(0,0)
Pad_e98
  round 1.524 hole 0.914: 27(0,0)
Pad_e99
  round 1.524 hole 0.914: 28(0,0)
Pad_e105
  round 1.524 hole 0.914: 29(0,0)
Pad_e106
  rect 1.524x1.524 hole 0.914: 30(0,0)
Pad_e115
  round 1.524 hole 0.914: 31(0,0)
Pad_e116
  round 1.524 hole 0.914: 32(0,0)
Pad_e117
  round 1.524 hole 0.914: 33(0,0)
Pad_e118
  round 1.524 hole 0.914: 34(0,0)
Pad_e119
  round 1.524 hole 0.914: 35(0,0)
Pad_e120
  round 1.524 hole 0.914: 36(0,0)
Pad_e121
  round 1.524 hole 0.914: 37(0,0)
Pad_e723
  round 1.524 hole 0.914: 38(0,0)
Pad_e1208
  round 1.524 hole 0.914: 24(0,0)
Pad_e1327
  round 1.524 hole 0.914: 40(0,0)
Pad_e1951
  round 1.524 hole 0.914: 38(0,0)
PWRM-TH_GXXXXS-2W
  rect 1.8x1.8 hole 1: 1(-7.62,0)
  round 1.8 hole 1: 2(-5.08,0) 5(2.54,0) 6(5.08,0) 7(7.62,0)
R1206
  rect 1.208x1.701 smd: 1(-1.479,0) 2(1.479,0)
SMA_L4.3-W2.5-LS5.0-RD
  rect 2x1.593 smd: 1(-2.1,0) 2(2.1,0)
SOIC-8_L4.9-W3.9-P1.27-LS6.0-TR
  oval 0.6x1.52 smd: 1(1.905,2.74) 2(0.635,2.74) 3(-0.635,2.74) 4(-1.905,2.74) 5(-1.905,-2.74) 6(-0.635,-2.74) 7(0.635,-2.74) 8(1.905,-2.74)
SOT-223-3_L6.5-W3.4-P2.30-LS7.0-BR
  rect 2.5x1.1 smd: 1(2.97,-2.3) 2(2.97,0) 3(2.97,2.3)
  rect 2.34x3.6 smd: 4(-2.97,0)
SW-TH_2P-L15.0-W10.5-P5.00_KCD11-2P-R
  oval 1.6x5 hole 0.8x4: 1(-2.5,0) 2(2.5,0)
SW-TH_SS-12D10L5
  round 2.5 hole 1.8: 1(-4.7,0) 2(0,0) 3(4.7,0)
TQFN-16_L4.0-W4.0-P0.65-BL-EP
  oval 0.364x1.087 smd: 1(-0.975,-1.968) 2(-0.325,-1.968) 3(0.325,-1.968) 4(0.975,-1.968) 9(0.975,1.968) 10(0.325,1.968) 11(-0.325,1.968) 12(-0.975,1.968)
  oval 1.087x0.364 smd: 5(1.968,-0.975) 6(1.968,-0.325) 7(1.968,0.325) 8(1.968,0.975) 13(-1.968,0.975) 14(-1.968,0.325) 15(-1.968,-0.325) 16(-1.968,-0.975)
  rect 2.1x2.1 smd: 17(0,0)

## Nets
AGND: AD1.14 AD1.16 ADS1.1 ADS1.3 C1.2 C2.1 C3.2 C4.2 C5.2 C6.1 C7.1 C8.2 C9.2 C10.1 C11.1 C12.2 C13.2 C14.1 C15.2 C21.1 C22.1 C27.1 C28.1 C29.1 D2.2 D4.2 NOREF.33 NOREF#10.30 NOREF#11.24 NOREF#16.23 R16.1 R17.1 R30.1 RQ.1 TP1.7 TP1.11 TP1.12 U1.1 U2.2 U3.2 U4.2 U4.6 XL1.4 XL1.5 XL1.6 XL1.7 XL1.8
VIN: C3.1 C4.1 C5.1 C6.2 D1.1 D5.2 R1.2 TP1.1 TP1.4 TP1.5 TP1.16
VIN+12V: D1.2 NOREF#20.29
1-OUT~50HZ: NE5532.1 NE5532.2 R11.2 SW3.3
2-OUT~50HZ: LM741.6 R28.2 SW3.1
$RQ_2: NOREF#12.32 RQ.2
$SW2_3: NOREF#2.31 SW2.3
BAT: C11.2 C12.1 D3.2 NOREF#13.22 R2.1 TP1.9
BATOUT: C2.2 SW1.2 U2.1 XL1.1
CHRG#: LED1.1 TP1.15
IAOUT: AD1.19 R4.2 R25.1
IN1+: C18.1 NE5532.3 R9.1
IN2+: NE5532.5 R11.1 R17.2
IN2-: C20.2 C23.2 NE5532.6 NE5532.7 R19.1
LA: NOREF#15.26 R13.2 R18.1
LOD+: AD1.12 NOREF#4.38
LOD-: AD1.11 NOREF#9.38
LX: D2.1 L1.2 TP1.2 TP1.3
OUT~50HZ: ADS1.4 SW3.2
RA: NOREF#8.27 R12.2 R20.1
REFIN: AD1.18 C22.2 R14.2 R16.2
REFOUT: AD1.8 C16.1 C25.2 R22.2
RL: NOREF#18.28 R21.1
SCL: ADS1.10 NOREF#14.24 R26.1
SDA: ADS1.9 NOREF#3.25 R27.1
SIGNALOUTPUT: AD1.10 C26.2 R23.1 SW2.2
STDBY#: LED2.2 TP1.14
SW: AD1.6 C16.2 R6.1
V+5V: C10.2 L2.2 LM741.7 NE5532.8 NOREF#19.36
V-5V: C13.1 C29.2 L4.2 LM741.4 NE5532.4 NOREF#5.37
VOUT3.3V: AD1.13 AD1.15 AD1.17 C21.2 NOREF#7.40 R12.1 R13.1 R14.1 U1.2 U1.4 U3.1
VOUT5V: ADS1.8 C1.1 C9.1 C15.1 C27.2 C28.2 L3.1 L5.2 R26.2 R27.2 U1.3 XL1.3
VS0: C7.2 C8.1 L1.1 R2.2 TP1.8
~F42N50OUT: NOREF#6.35 NOREF#17.34 R29.1
$1N3439: D4.1 L3.2 XL1.2
$1N4811: AD1.1 C19.1
$1N5112: AD1.20 C19.2 R3.1
$1N5226: R5.1 R6.2
$1N5744: R3.2 R4.1 R5.2
$1N5889: AD1.2 R18.2
$1N5893: AD1.3 R20.2
$1N6263: AD1.4 C24.2
$1N6271: AD1.5 C24.1 R21.2
$1N6443: C26.1 R24.1 R25.2
$1N6667: AD1.7 C25.1 R24.2
$1N6683: AD1.9 R22.1 R23.2
$1N9016: LED1.2 LED2.1 R1.1
$1N9469: C14.2 TP1.10 TP1.13
$1N13462: D3.1 D5.1 SW1.1
$1N13836: C20.1 C23.1 R8.2 R10.2
$1N13923: R7.2 R8.1
$1N14048: R9.2 R10.1
$1N14109: C17.1 C18.2 R15.2
$1N14110: R15.1 R19.2
$1N16761: C17.2 R7.1 SW2.1
$1N17392: LM741.3 R30.2
$1N29763: LM741.2 R28.1 R29.2
$1N30838: L5.1 U4.1
$1N30849: L4.1 U4.5
$1N30860: L2.1 U4.7

Pads without a net: AD1 21; ADS1 2 5 6 7; LM741 1 5 8; TP1 6 17

## Via types
v1: diameter 0.61, hole 0.305, Top Layer to Bottom Layer, 174 vias
v2: diameter 1.016, hole 0.508, Top Layer to Bottom Layer, 2 vias

## Routing (per net, layer and track width the routed paths; a pad name or vN(x,y) marks a point on that pad's centre or on a via; arc(x,y) is an arc through that point)
AGND: length 56.7
  Top Layer w0.254: v1(20.83,32.69) 20.83,31.93 21.07,31.68 AD1.16 ; 67.56,18.34 66.63,17.4 ADS1.1 ; 67.56,18.34 67.18,18.72 65.79,18.72 65.28,18.21 ADS1.3 ; 67.56,18.34 68.45,18.34 68.58,18.47 ; v1(22.73,34.47) 22.99,34.22 AD1.14 ; TP1.11 TP1.12 ; 20,78.48 20.67,78.48 20.87,78.28 23.5,78.28
  Bottom Layer w0.254: v1(29.97,25.83) v1(25.91,25.83) ; v1(19.3,24.35) 20.32,25.37 v1(20.32,28.12) ; v1(21.59,80.7) v1(21.59,84) ; v1(12.45,82.98) 13.21,82.98 v1(15.49,80.7) ; v1(13.46,76.38) v1(13.46,73.33) ; v1(25.91,24.26) v1(29.97,24.26) ; v1(20.83,32.69) 20.83,32.94 22.35,34.47 v1(22.73,34.47) 26.16,34.47 v1(27.18,33.45) v1(28.96,33.45) 29.97,32.44 v1(29.97,27.4) v1(25.91,27.4)
  vias: v1(1.16,93.14) v1(1.18,91.87) v1(1.23,57.07) v1(1.27,98.31) v1(1.27,96.74) v1(1.27,95.17) v1(1.78,64.74) v1(1.78,63.17) v1(1.78,61.6) v1(2.54,98.33) v1(2.54,96.75) v1(2.54,95.17) v1(2.74,93.14) v1(2.75,91.87) v1(2.79,57.07) v1(3.3,64.74) v1(3.3,63.17) v1(3.3,61.6) v1(4.32,93.14) v1(4.32,91.87) v1(4.36,57.07) v1(5.84,93.14) v1(5.84,91.87) v1(6.05,57.07) v1(6.35,38.02) v1(6.35,36.75) v1(7.41,93.14) v1(7.42,91.87) v1(7.62,57.07) v1(7.92,38.02) v1(7.93,36.75) v1(8.98,93.14) v1(9,91.87) v1(9.19,57.07) v1(9.49,38.02) v1(9.5,36.75) v1(10.88,57.07) v1(12.45,57.07) v1(14.01,57.07) v1(14.73,25.37) v1(14.73,23.8) v1(14.73,22.23) v1(14.73,7.29) v1(14.73,6.02) v1(14.99,4.33) v1(14.99,2.76) v1(14.99,1.19) v1(15.45,57.07) v1(16.3,7.29) v1(16.31,6.02) v1(16.26,4.35) v1(16.26,2.77) v1(16.26,1.19) v1(17.02,57.07) v1(17.78,31.67) v1(17.78,30.11) v1(17.87,7.29) v1(17.89,6.02) v1(18.59,57.07) v1(19.3,22.78) v1(19.3,21.22) v1(20.53,57.07) v1(22.1,57.07) v1(23.67,57.07) v1(25.36,57.07) v1(25.4,51.32) v1(25.4,49.75) v1(25.4,48.18) v1(26.67,51.34) v1(26.67,49.76) v1(26.67,48.18) v1(26.92,57.07) v1(28.49,57.07) v1(30.94,57.07) v1(30.99,58.09) v1(32.51,57.07) v1(32.56,58.09) v1(33.27,5.26) v1(34.12,58.09) v1(34.08,57.07) v1(34.42,5.26) v1(35.56,5.26) v1(37.72,5.26) v1(38.1,77.69) v1(38.1,76.12) v1(38.1,74.56) v1(38.1,72.87) v1(38.1,71.3) v1(38.1,69.73) v1(38.86,5.26) v1(40,5.26) v1(41.33,98.38) v1(41.33,96.82) v1(41.33,95.25) v1(42.04,5.26) v1(42.6,98.4) v1(42.6,96.83) v1(42.6,95.25) v1(43.18,5.26) v1(44.2,98.41) v1(44.2,96.84) v1(44.2,95.28) v1(44.32,5.26) v1(44.32,3.61) v1(44.32,2.46) v1(44.32,1.32) v1(44.7,38.15) v1(44.7,37.01) v1(44.7,35.86) v1(44.7,34.85) v1(44.7,33.71) v1(44.7,32.56) v1(45.47,98.43) v1(45.47,96.85) v1(45.47,95.28) v1(58.29,3.1) v1(58.29,1.96) v1(58.29,0.81) v1(75.95,3.23) v1(75.95,2.08) v1(75.95,0.94) v1(87.88,15.54) v1(89.03,15.54) v1(90.17,15.54) v1(98.81,74.39) v1(98.81,72.82) v1(98.81,71.25) v1(99.06,66.22) v1(99.06,64.44) v1(99.06,62.87)
VIN: length 70.1
  Top Layer w0.508: R1.2 11.28,85.98 D1.1 17.02,85.96 D5.2 17.47,85.83 19.05,84.25 19.05,83.36 18.29,82.6 14.73,82.6 v1(13.33,81.2) ; 32,62.77 32.51,63.28 32.51,75.5 30.94,77.08 C6.2 26.19,77.18 20,77.18 TP1.4 19.52,75.68 19.52,74.05 18.54,73.08 17.53,73.08 17.06,73.54 TP1.1 16.07,77.18 15.28,77.18 14.86,76.76 14.86,75.62 14.35,75.11 12.7,75.11 v1(12.19,75.62)
  Bottom Layer w0.508: v1(12.19,75.62) 12.19,80.06 v1(13.33,81.2)
VIN+12V: length 7
  Top Layer w0.635: D1.2 NOREF#20.29
1-OUT~50HZ: length 33.4
  Top Layer w0.254: R11.2 71.63,46.41 72.52,45.52 72.52,37.52 73.53,36.5 NE5532.2 NE5532.1 77.72,33.83 SW3.3
2-OUT~50HZ: length 23.9
  Top Layer w0.254: SW3.1 91.95,22.15 93.34,23.55 93.34,27.91 R28.2 96.9,27.99 97.79,28.88 97.79,34.19 96.24,35.74 LM741.6
$RQ_2: length 4.2
  Top Layer w0.254: v1(84.47,54.96) 84.47,50.82 RQ.2
$SW2_3: length 44.2
  Top Layer w0.254: NOREF#2.31 78.04,56.31 55.37,56.31 51.31,52.25 37.47,52.25
BAT: length 41.4
  Top Layer w0.508: D3.2 38.5,83.95 R2.1 33.61,84.12 C11.2 ; C11.2 28.19,84.18 C12.1 31.64,88.84 33.02,90.22 NOREF#13.22 ; C11.2 28.14,83.81 26.42,82.09 19.81,82.09 19.01,81.29 TP1.9
BATOUT: length 33
  Top Layer w0.508: XL1.1 82.8,91.55 C2.2 74.57,91.3 U2.1 73.37,90.09 SW1.2
CHRG#: length 10.3
  Top Layer w0.254: TP1.15 12.38,77.83 11.3,76.76 LED1.1
IAOUT: length 62.1
  Top Layer w0.254: v1(40.13,21.01) 39.37,20.24 38.06,20.24 ; AD1.19 21.58,30.15 20.07,30.15 18.42,28.5 17.27,28.5 15.62,30.15 15.62,33.33 15.37,33.58 14.18,33.58 R4.2 14.43,34.34 v1(17.53,34.34)
  Bottom Layer w0.254: v1(17.53,34.34) 18.67,35.48 30.63,35.48 32.41,37.26 41.4,37.26 42.42,36.25 42.42,24.31 41.91,23.8 40.64,23.8 40.13,23.29 v1(40.13,21.01)
IN1+: length 51.3
  Top Layer w0.254: v1(71.63,27.99) 69.22,25.58 C18.1 ; NE5532.3 75.06,39.04 74.42,39.67 74.42,52.88 73.41,53.9 66.25,53.9
  Bottom Layer w0.254: v1(71.63,27.99) 71.63,27.86 78.61,27.86 79.76,29.01 79.76,36.88 NE5532.3
IN2+: length 12.9
  Top Layer w0.254: NE5532.5 65.91,41.58 64.43,43.06 R11.1 64.69,46.66 R17.2
IN2-: length 20.3
  Top Layer w0.254: R19.1 60.65,32.42 60.65,35.86 ; 60.65,35.86 C23.2 ; 60.65,35.86 C20.2 68.96,40.06 NE5532.6 NE5532.7
LA: length 12.8
  Top Layer w0.254: R18.1 21.04,14.8 R13.2 21.08,10.29 NOREF#15.26
LOD+: length 6.9
  Top Layer w0.254: AD1.12 23.99,39.02 24.26,39.29
LOD-: length 10
  Top Layer w0.254: NOREF#9.38 28.07,37.26 27.43,36.63 24.77,36.63 24.49,36.35 AD1.11
LX: length 21.8
  Top Layer w0.254: TP1.3 TP1.2
  Top Layer w0.508: v1(18.29,74.6) 18.36,74.67 TP1.3 ; D2.1 18.16,63.3 18.29,63.42 v1(18.29,71.55)
  Bottom Layer w0.508: v1(18.29,74.6) v1(18.29,71.55)
OUT~50HZ: length 21.2
  Top Layer w0.254: ADS1.4 64.78,18.6 65.53,19.35 81.15,19.35 82.42,20.62 SW3.2
RA: length 12.8
  Top Layer w0.254: NOREF#8.27 25.4,10.29 25.44,10.34 25.44,14.79 R20.1
REFIN: length 27.8
  Top Layer w0.254: R14.2 10.46,49.05 10.46,45.52 10.35,45.4 C22.2 10.35,39.49 11.81,38.02 18.16,38.02 19.18,37.01 19.18,31.55 20.07,30.66 21.59,30.66 AD1.18
REFOUT: length 30.8
  Top Layer w0.254: C16.1 42,20.72 41.4,21.31 41.4,25.58 40.64,26.34 37.08,26.34 36.83,26.59 36.83,28.63 36.32,29.13 R22.2 33.53,29.13 32,30.66 25.38,30.66 25.35,30.68
RL: length 8.7
  Top Layer w0.254: NOREF#18.28 29.97,6.78 31.72,8.53 31.72,10.09
SCL: length 12.2
  Top Layer w0.254: NOREF#14.24 67.61,1.52 R26.1 67.31,8.48 67.31,10.47 66.28,11.5 ADS1.10
SDA: length 12.1
  Top Layer w0.254: NOREF#3.25 64.79,8.24 64.72,8.31 64.77,8.35 64.77,10.47 65.78,11.47 ADS1.9
SIGNALOUTPUT: length 42.3
  Top Layer w0.254: C26.2 38.06,32.6 R23.1 ; C26.2 33.53,35.48 32.89,34.85 32.89,32.56 32,31.67 25.36,31.67 25.35,31.68 ; C26.2 35.17,38.67 33.27,40.56 30.35,40.56 28.45,42.47 28.45,46.66 29.21,47.42 37.34,47.42 SW2.2
STDBY#: length 14.8
  Top Layer w0.254: 16.07,78.48 11.75,78.48 10.29,77.01 10.29,73.84 8.35,71.9 LED2.2
SW: length 72.9
  Top Layer w0.254: C16.2 34.8,14.4 33.53,15.67 33.53,18.78 ; 25.35,29.68 26.5,29.68 27.18,29.01 27.18,22.78 28.19,21.77 31.75,21.77 33.53,19.99 33.53,18.78 ; R6.1 25.74,38.83 v1(25.91,38.66) ; 33.53,18.78 33.53,19.35
  Bottom Layer w0.254: v1(25.91,38.66) 26.54,38.02 42.04,38.02 43.56,36.5 43.56,18.21 42.5,17.16 39.75,17.16 C16.2
V+5V: length 100
  Top Layer w0.254: LM741.7 98.04,40.44 98.04,60.88 96.27,62.66 C10.2 ; L2.2 89.48,66.54 C10.2 ; C10.2 89.48,55.55 89.73,55.29
  Bottom Layer w0.254: NE5532.8 69.6,33.58 64.26,33.58 62.48,35.36 62.48,49.96 64.26,51.74 71.75,51.74 73.28,50.22 88.65,50.22 89.66,51.23 89.66,54.85 NOREF#19.36
V-5V: length 65
  Top Layer w0.254: v1(92.71,64.31) 93.78,65.39 C29.2 93.98,67.3 C13.1 93.92,71.55 L4.2 ; LM741.4 83.44,33.2 82.55,34.09 82.55,39.04 80.01,41.58 NE5532.4 77.6,45.64 78.49,46.53 80.65,46.53 82.04,47.93 82.04,54.85 NOREF#5.37
  Bottom Layer w0.254: v1(92.71,64.31) 92.71,59.87 91.95,59.11 82.8,59.11 81.91,58.22 81.91,54.98 NOREF#5.37
VOUT3.3V: length 176.2
  Top Layer w0.254: C21.2 17.97,54.34 19.29,55.66 36.18,55.66 37.34,56.82 37.34,63.42 40.13,66.22 43.32,66.22 ; C21.2 17.97,40.63 18.54,40.06 20.07,40.06 20.83,39.29 20.83,38.89 ; C21.2 R14.1 13.33,49.13 13.33,51.36 12.45,52.25 5.84,52.25 4.44,50.85 4.44,12.24 6.35,10.34 R13.1 18.08,14.7 v1(18.29,14.91) ; 43.32,66.22 43.64,65.9 U1.4 U1.2 ; 43.32,66.22 U3.1 ; v1(28.45,14.91) 28.45,10.38 28.4,10.34 ; AD1.17 20.83,31.18 20.07,31.95 20.07,33.32 20.83,34.08 ; 20.83,38.89 20.83,34.08 ; 20.83,38.89 20.85,38.91 NOREF#7.40 23.49,37.78 AD1.13 ; 20.83,34.08 20.95,34.08 21.58,33.45 22.1,33.45 22.49,33.06 AD1.15
  Bottom Layer w0.254: v1(18.29,14.91) 19.56,16.18 27.18,16.18 v1(28.45,14.91)
VOUT5V: length 165.1
  Top Layer w0.254: 65.84,68.19 C27.2 63.5,64.44 58.93,59.87 ; 65.84,68.19 L3.1 70.23,72.58 70.23,82.35 71.75,83.87 88.41,83.87 88.65,83.63 ; 65.84,68.19 65.81,68.15 C9.1 54.84,68.12 50.8,68.12 49.58,66.9 U1.3 ; 88.65,83.63 88.9,83.38 ; 88.65,83.63 88.65,86.16 91.95,89.46 XL1.3 ; C28.2 58.74,20.44 v1(58.8,20.5) ; C28.2 58.74,9 59.31,8.43 61.64,8.43 61.72,8.35 ; C28.2 69.6,14.91 70.57,13.94 R26.2 ; 61.72,8.35 61.72,10.34 62.61,11.23 64.52,11.23 65.28,11.99 ADS1.8 ; 61.72,8.35 R27.2 ; C15.1 93.14,83.76 L5.2
  Bottom Layer w0.254: v1(59.42,60.38) 58.8,59.76 v1(58.8,20.5)
VS0: length 48.3
  Top Layer w0.254: TP1.8 23.07,79.13 v1(23.11,79.17)
  Top Layer w0.508: C8.1 44.64,74.64 C7.2 44.46,81 R2.2 24.94,81 v1(23.11,79.17) ; v1(23.24,70.79) 23.24,67.36 21.88,66 L1.1
  Bottom Layer w0.508: v1(23.24,70.79) 23.24,79.05 v1(23.11,79.17)
~F42N50OUT: length 11.5
  Top Layer w0.254: NOREF#6.35 94.38,54.71 92.2,54.71 92.2,47.47 R29.1
$1N3439: length 38.7
  Top Layer w0.254: L3.2 65.98,74.15 v1(65.98,79.3) 66.17,79.48 66.17,84.63 67.69,86.16 86.36,86.16 90.68,90.47 XL1.2
$1N4811: length 16.8
  Top Layer w0.254: AD1.1 22.48,28.81 22.48,27.61 21.72,26.85 17.78,26.85 16.72,25.79 C19.1
$1N5112: length 23.9
  Top Layer w0.254: C19.2 11.72,21.3 12.7,22.28 12.7,28.93 R3.1 14.61,30.15 17.02,27.74 18.67,27.74 20.62,29.68 AD1.20
$1N5226: length 3
  Top Layer w0.254: R5.1 R6.2
$1N5744: length 13.2
  Top Layer w0.254: R3.2 R4.1 v1(13.56,36.42) ; v1(16.76,39.63) 16.76,40.94
  Bottom Layer w0.254: v1(13.56,36.42) v1(16.76,39.63)
  vias: v1(16.76,39.55)
$1N5889: length 11.7
  Top Layer w0.254: 22.91,28.73 22.91,19.63 R18.2
$1N5893: length 11.6
  Top Layer w0.254: 23.57,28.68 23.57,19.63 R20.2
$1N6263: length 15.3
  Top Layer w0.254: AD1.4 23.99,21.02 24.77,20.24 28.32,20.24 28.7,19.86 28.7,17.66 28.76,17.6
$1N6271: length 22.2
  Top Layer w0.254: R21.2 31.95,13.28 31.95,19.79 30.86,20.88 25.4,20.88 24.49,21.79 AD1.5
$1N6443: length 21.6
  Top Layer w0.254: 35.1,20.24 36.07,20.24 36.83,21.01 36.83,23.04 37.08,23.29 v1(38.06,23.29) ; C26.1 40.13,35.48 v1(41.02,34.59)
  Bottom Layer w0.254: v1(38.06,23.29) 39.12,23.29 40.39,24.56 40.39,29.9 41.02,30.53 v1(41.02,34.59)
$1N6667: length 15.4
  Top Layer w0.254: 25.35,30.18 25.43,30.1 31.54,30.1 33.02,28.63 33.02,26.85 33.27,26.59 34.73,26.59 34.98,26.34 35.1,26.23 35.1,23.29
$1N6683: length 15.6
  Top Layer w0.254: R22.1 37.55,29.64 36.83,29.64 36.58,29.9 36.58,31.93 36.32,32.18 35.16,32.18 35.03,32.05 33.14,32.05 32.28,31.18 25.35,31.18
$1N9016: length 25.1
  Top Layer w0.254: LED1.2 11.06,68.92 LED2.1 3.4,68.92 2.67,69.65 2.67,82.22 3.3,82.86 5.67,82.86 R1.1
$1N9469: length 14.3
  Top Layer w0.254: C14.2 14.67,79.1 ; 14.67,79.1 14.67,80.89 15.49,81.71 17.44,81.71 18.36,80.8 TP1.10 ; 14.67,79.1 16.03,79.1 TP1.13
$1N13462: length 39.9
  Top Layer w0.508: v2(19.21,93.02) 18.29,93.02 17.14,91.87 D5.1 ; 51.86,90.47 51.16,89.78 D3.1 40.13,91.87 38.99,93.02 v2(37.47,93.02)
  Bottom Layer w0.508: v2(37.47,93.02) v2(19.21,93.02)
$1N13836: length 12.4
  Top Layer w0.254: R8.2 57.21,35.61 C23.1 57.34,39.93 ; 57.34,39.93 C20.1 ; 57.34,39.93 57.34,42.74 57.7,43.1
$1N13923: length 3.6
  Top Layer w0.254: R8.1 49.7,32.06 R7.2
$1N14048: length 12.1
  Top Layer w0.254: R10.1 60.45,43.31 60.45,51.06 R9.2
$1N14109: length 10.2
  Top Layer w0.254: C18.2 63,25.62 R15.2 57.23,25.45 C17.1
$1N14110: length 3.8
  Top Layer w0.254: 57.4,28.58 57.58,28.75 R19.2
$1N16761: length 27.3
  Top Layer w0.254: SW2.1 44.58,42.85 46.1,41.33 46.1,30.4 47.45,29.05 49.06,29.05 ; R7.1 49.66,25.51 C17.2
$1N17392: length 4.3
  Top Layer w0.254: LM741.3 87.76,36.25 R30.2
$1N29763: length 24.4
  Top Layer w0.254: R29.2 86.23,46.28 84.84,44.88 84.84,39.42 85.98,38.28 LM741.2 90.47,36.07 R28.1
$1N30838: length 8.2
  Top Layer w0.254: L5.1 88.66,80.44 U4.1
$1N30849: length 6.2
  Top Layer w0.254: U4.5 82.04,71.55 L4.1
$1N30860: length 6.2
  Top Layer w0.254: 86.35,66.6 84.2,66.6 82.8,65.2 U4.7

## Copper pours and planes (outline as drawn; the poured copper is in the pictures)
AGND on Top Layer: 19.31,82.09 26.67,82.09 26.67,79.43 19.31,79.43
AGND on Top Layer: 11.68,77.65 15.24,77.65 15.24,75.36 11.68,75.36
AGND on Top Layer: -4.19,100.76 106.55,100.76 106.55,-3 -4.19,-3

Small or netless copper shapes (teardrops, artwork), in the pictures only: 297 on Top Layer, 51 on Bottom Layer

## Text on the board
Top Silkscreen Layer: ~SDN | LOD+ | +5V | -5V | GND | +12V | LA | RA | RL | LOD- | BUS | IIC | VIN | V- | RQ | V+ | RG | VO | + | - | F42N50模块 | 自制陷波器 | 电池充电 | 褚玘铖  陈亦乔 / 朱若玫  严旭铧 | 心电信号输入 | 心电信号 / 采集板
